# EAGLE design legatus_v0_3 (EAGLE 9.6.2)
CNAME: Parrot Teensy Board; CREVISION: 1.0; DESIGNER: Nathan Villicana-Shaw

## Sheet 1 of 3
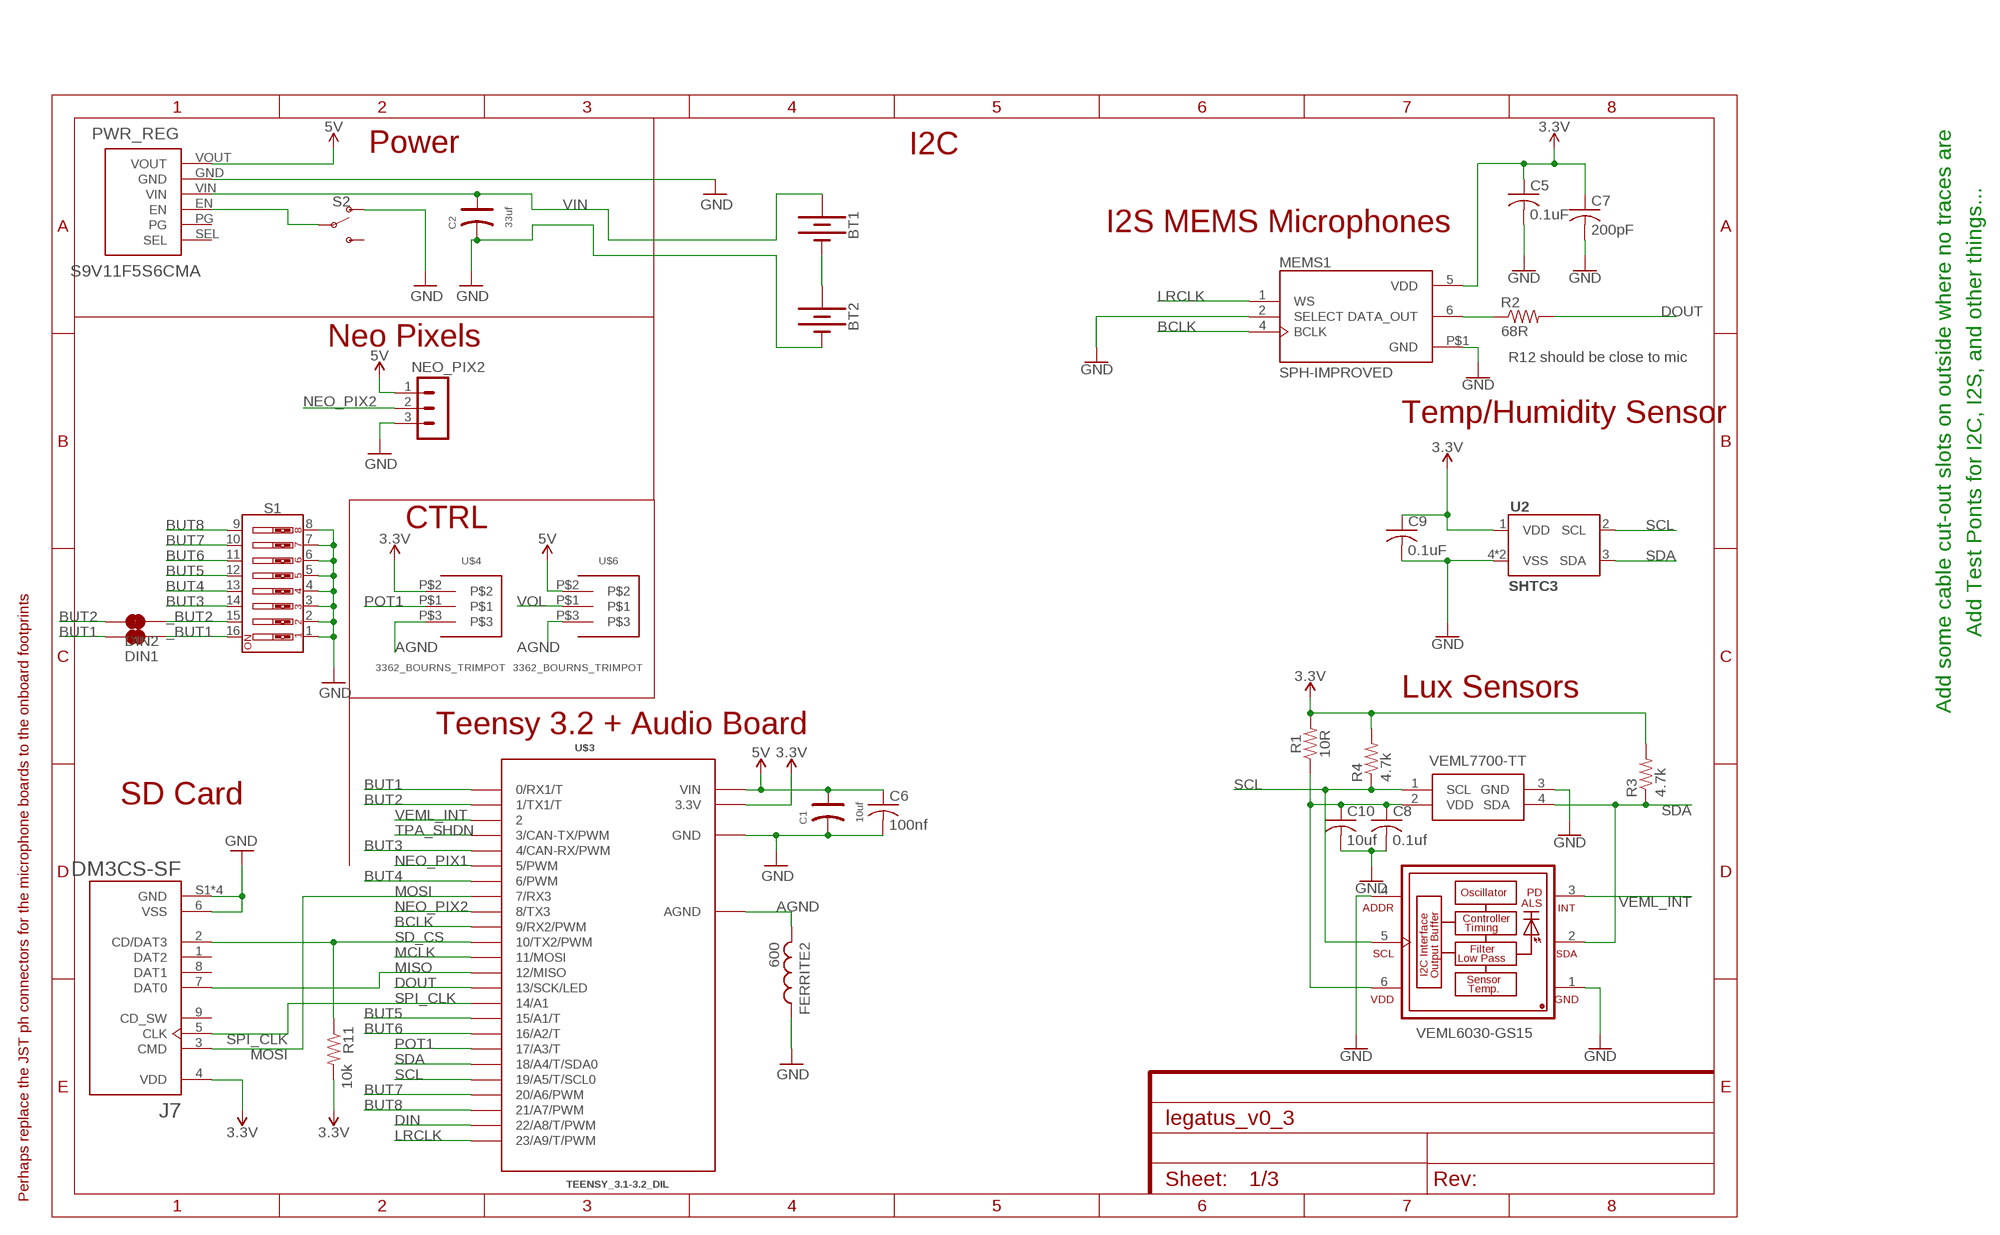
[diagram p0: schematic, sheet 1]

### Parts
BT1  BATTERY-18650  [BATTERY_18650-HOLDER]
BT2  BATTERY-18650  [BATTERY_18650-HOLDER]
C1  10uf  DIP-ALUMINUM-47UF-16V(D5-H7MM)  [PC-D5.3MM]
C2  33uf  DIP-ALUMINUM-47UF-16V(D5-H7MM)  [PC-D5.3MM]
C5  0.1uF  C-USC0805  [C0805]
C6  100nf  C-USC2012  [C2012]
C7  200pF  C-USC0805  [C0805]
C8  0.1uf  C-USC0805  [C0805]
C9  0.1uF  C-USC0805  [C0805]
C10  10uf  C-USC0805  [C0805]
DIN1  JUMPER-SMT_2_NC_TRACE_SILK  [SMT-JUMPER_2_NC_TRACE_SILK]
DIN2  JUMPER-SMT_2_NC_TRACE_SILK  [SMT-JUMPER_2_NC_TRACE_SILK]
FERRITE2  600  INDUCTOR_0805_N  [RESC0805_N]
J7  DM3CS-SF  [HRS_DM3CS-SF]
MEMS1  SPH-IMPROVED  [MIC_SPH0645LM4H-B_LARGER_RING]
NEO_PIX2  B3B-PH-K  [B3B-PH-K]
PWR_REG  S9V11F5S6CMA  [S9V11F3S5CMA]
R1  10R  R-US_R0805  [R0805]
R2  68R  R-US_M0805  [M0805]
R3  4.7k  R-US_M0805  [M0805]
R4  4.7k  R-US_M0805  [M0805]
R11  10k  R-US_M0805  [M0805]
S1  DIP-08-PTH  [DIPSWITCH-08]
S2  SWITCH-SPDT-PTH-11.6X4.0MM-LOCK  [SWITCH_SPDT_PTH_11.6X4.0MM_LOCK]
U2  SHTC3  [SHTC3]
U$3  TEENSY_3.1-3.2_DIL  [TEENSY_3.0-3.2&LC_DIL]
U$4  3362_BOURNS_TRIMPOT  [3362_BOURNS_TRIMPOT]
U$6  3362_BOURNS_TRIMPOT  [3362_BOURNS_TRIMPOT]
VEML1  VEML7700-TT  [VEML7700]
VMEL1  VEML6030-GS15  [VISHAY_VEML6030_2X2X0.87]

### Nets
3.3V [3.3V]: C5.1 C7.1 C9.1 J7.4(VDD) MEMS1.5(VDD) R1.2 R3.2 R4.2 R11.2 U2.1(VDD) U$3.3.3V U$4.P$2 ; also sheet 3
5V: C1.+ C6.1 NEO_PIX2.1 PWR_REG.VOUT U$3.VIN U$6.P$2 ; also sheet 2,3
_BUT1: DIN1.2 S1.16
_BUT2: DIN2.2 S1.15
AGND [AGND]: FERRITE2.2 U$3.AGND U$4.P$3 U$6.P$3 ; also sheet 3
BCLK: MEMS1.4(BCLK) U$3.9(9/RX2/PWM) ; also sheet 3
BUT1: DIN1.1 U$3.0(0/RX1/T)
BUT2: DIN2.1 U$3.1(1/TX1/T)
BUT3: S1.14 U$3.4(4/CAN-RX/PWM)
BUT4: S1.13 U$3.6(6/PWM)
BUT5: S1.12 U$3.15/A1(15/A1/T)
BUT6: S1.11 U$3.16/A2(16/A2/T)
BUT7: S1.10 U$3.20/A6(20/A6/PWM)
BUT8: S1.9 U$3.21/A7(21/A7/PWM)
DIN: U$3.22/A8(22/A8/T/PWM) ; also sheet 3
DOUT: R2.2 U$3.13(13/SCK/LED) ; also sheet 3
GND: BT2.GND@1(-) C1.- C2.- C5.2 C6.2 C7.2 C8.2 C9.2 C10.2 FERRITE2.1 J7.6(VSS) J7.S1(GND) J7.S2(GND) J7.S3(GND) J7.S5(GND) MEMS1.2(SELECT) MEMS1.P$1(GND) NEO_PIX2.3 PWR_REG.GND S1.1 S1.2 S1.3 S1.4 S1.5 S1.6 S1.7 S1.8 S2.1(O) U2.4(VSS) U2.5(VSS) U$3.GND VEML1.3(GND) VMEL1.1(GND) VMEL1.4(ADDR) ; also sheet 2,3
LRCLK: MEMS1.1(WS) U$3.23/A9(23/A9/T/PWM) ; also sheet 3
MCLK: U$3.11(11/MOSI) ; also sheet 3
MISO: J7.7(DAT0) U$3.12(12/MISO)
MOSI: J7.3(CMD) U$3.7(7/RX3)
N$1: MEMS1.6(DATA_OUT) R2.1
N$4: C8.1 C10.1 R1.1 VEML1.2(VDD) VMEL1.6(VDD)
N$5: PWR_REG.EN S2.2(P)
N$22: BT1.GND@1(-) BT2.PWR@1(+)
NEO_PIX1: U$3.5(5/PWM) ; also sheet 2
NEO_PIX2: NEO_PIX2.2 U$3.8(8/TX3)
POT1: U$3.17/A3(17/A3/T) U$4.P$1
SCL: R4.1 U2.2(SCL) U$3.19/A5(19/A5/T/SCL0) VEML1.1(SCL) VMEL1.5(SCL) ; also sheet 3
SD_CS: J7.2(CD/DAT3) R11.1 U$3.10(10/TX2/PWM)
SDA: R3.1 U2.3(SDA) U$3.18/A4(18/A4/T/SDA0) VEML1.4(SDA) VMEL1.2(SDA) ; also sheet 3
SPI_CLK: J7.5(CLK) U$3.14/A0(14/A1)
TPA_SHDN: U$3.3(3/CAN-TX/PWM) ; also sheet 3
VEML_INT: U$3.2 VMEL1.3(INT)
VIN [12V_IN]: BT1.PWR@1(+) C2.+ PWR_REG.VIN
VOL: U$6.P$1 ; also sheet 3
Unconnected: J7.1(DAT2) J7.8(DAT1) J7.9(CD_SW) PWR_REG.PG PWR_REG.SEL S2.3(S)

### Notes on the sheet
- Power | I2C
- I2S MEMS Microphones
- Neo Pixels
- R12 should be close to mic
- Temp/Humidity Sensor
- CTRL
- Add Test Ponts for I2C, I2S, and other things...
- Lux Sensors
- Add some cable cut-out slots on outside where no traces are
- Teensy 3.2 + Audio Board
- 10R
- SD Card
- Perhaps replace the JST ph connectors for the microphone boards to the onboard footprints

## Sheet 2 of 3: Neopixel LEDs
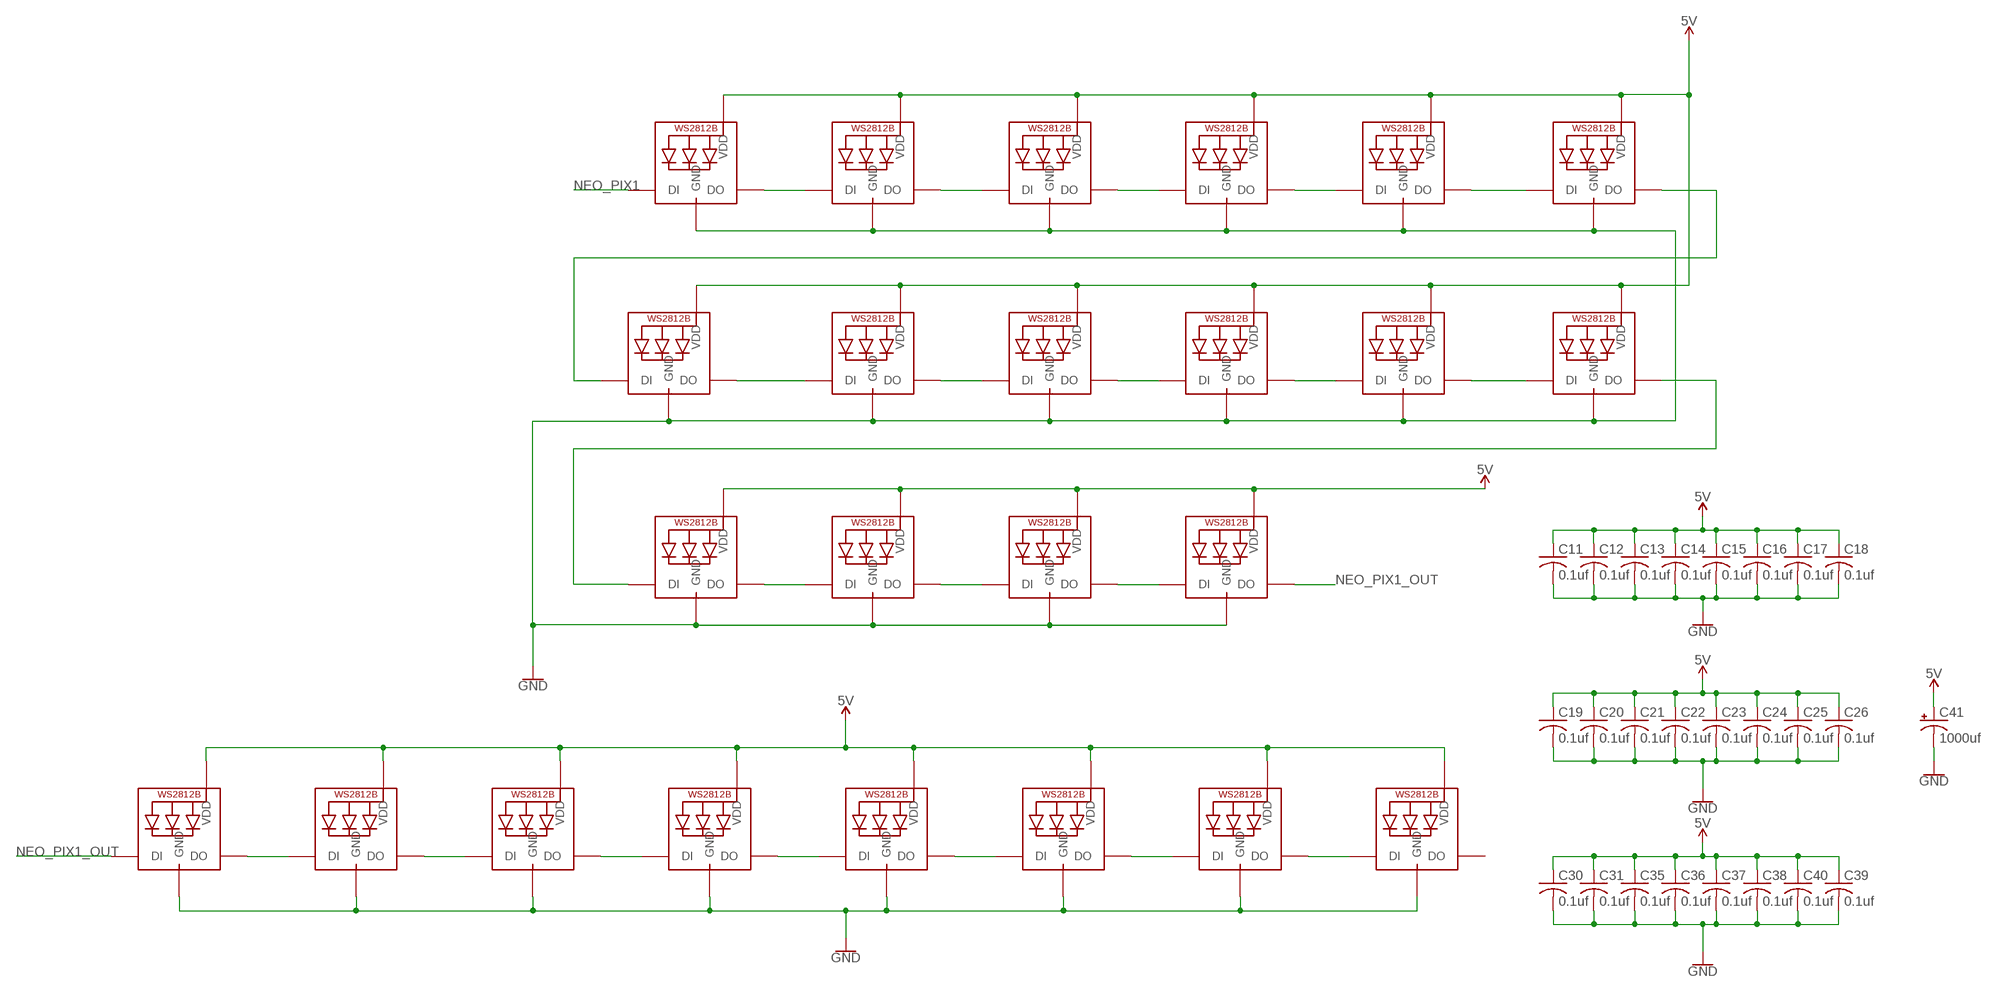
[diagram p1: schematic, sheet 2]

### Parts
C11  0.1uf  C-USC0805  [C0805]
C12  0.1uf  C-USC0805  [C0805]
C13  0.1uf  C-USC0805  [C0805]
C14  0.1uf  C-USC0805  [C0805]
C15  0.1uf  C-USC0805  [C0805]
C16  0.1uf  C-USC0805  [C0805]
C17  0.1uf  C-USC0805  [C0805]
C18  0.1uf  C-USC0805  [C0805]
C19  0.1uf  C-USC0805  [C0805]
C20  0.1uf  C-USC0805  [C0805]
C21  0.1uf  C-USC0805  [C0805]
C22  0.1uf  C-USC0805  [C0805]
C23  0.1uf  C-USC0805  [C0805]
C24  0.1uf  C-USC0805  [C0805]
C25  0.1uf  C-USC0805  [C0805]
C26  0.1uf  C-USC0805  [C0805]
C30  0.1uf  C-USC0805  [C0805]
C31  0.1uf  C-USC0805  [C0805]
C35  0.1uf  C-USC0805  [C0805]
C36  0.1uf  C-USC0805  [C0805]
C37  0.1uf  C-USC0805  [C0805]
C38  0.1uf  C-USC0805  [C0805]
C39  0.1uf  C-USC0805  [C0805]
C40  0.1uf  C-USC0805  [C0805]
C41  1000uf  CPOL-US153CLV-1010  [153CLV-1010]
LED1  WS2812B_5050N  [WS2812B-NARROW]
LED2  WS2812B_5050N  [WS2812B-NARROW]
LED3  WS2812B_5050N  [WS2812B-NARROW]
LED4  WS2812B_5050N  [WS2812B-NARROW]
LED5  WS2812B_5050N  [WS2812B-NARROW]
LED6  WS2812B_5050N  [WS2812B-NARROW]
LED7  WS2812B_5050N  [WS2812B-NARROW]
LED8  WS2812B_5050N  [WS2812B-NARROW]
LED9  WS2812B_5050N  [WS2812B-NARROW]
LED10  WS2812B_5050N  [WS2812B-NARROW]
LED11  WS2812B_5050N  [WS2812B-NARROW]
LED12  WS2812B_5050N  [WS2812B-NARROW]
LED13  WS2812B_5050N  [WS2812B-NARROW]
LED14  WS2812B_5050N  [WS2812B-NARROW]
LED15  WS2812B_5050N  [WS2812B-NARROW]
LED16  WS2812B_5050N  [WS2812B-NARROW]
LED17  WS2812B_5050N  [WS2812B-NARROW]
LED18  WS2812B_5050N  [WS2812B-NARROW]
LED19  WS2812B_5050N  [WS2812B-NARROW]
LED20  WS2812B_5050N  [WS2812B-NARROW]
LED21  WS2812B_5050N  [WS2812B-NARROW]
LED22  WS2812B_5050N  [WS2812B-NARROW]
LED23  WS2812B_5050N  [WS2812B-NARROW]
LED24  WS2812B_5050N  [WS2812B-NARROW]

### Nets
5V: C11.1 C12.1 C13.1 C14.1 C15.1 C16.1 C17.1 C18.1 C19.1 C20.1 C21.1 C22.1 C23.1 C24.1 C25.1 C26.1 C30.1 C31.1 C35.1 C36.1 C37.1 C38.1 C39.1 C40.1 C41.+ LED1.1-VDD(VDD) LED2.1-VDD(VDD) LED3.1-VDD(VDD) LED4.1-VDD(VDD) LED5.1-VDD(VDD) LED6.1-VDD(VDD) LED7.1-VDD(VDD) LED8.1-VDD(VDD) LED9.1-VDD(VDD) LED10.1-VDD(VDD) LED11.1-VDD(VDD) LED12.1-VDD(VDD) LED13.1-VDD(VDD) LED14.1-VDD(VDD) LED15.1-VDD(VDD) LED16.1-VDD(VDD) LED17.1-VDD(VDD) LED18.1-VDD(VDD) LED19.1-VDD(VDD) LED20.1-VDD(VDD) LED21.1-VDD(VDD) LED22.1-VDD(VDD) LED23.1-VDD(VDD) LED24.1-VDD(VDD) ; also sheet 1,3
GND: C11.2 C12.2 C13.2 C14.2 C15.2 C16.2 C17.2 C18.2 C19.2 C20.2 C21.2 C22.2 C23.2 C24.2 C25.2 C26.2 C30.2 C31.2 C35.2 C36.2 C37.2 C38.2 C39.2 C40.2 C41.- LED1.3-GND(GND) LED2.3-GND(GND) LED3.3-GND(GND) LED4.3-GND(GND) LED5.3-GND(GND) LED6.3-GND(GND) LED7.3-GND(GND) LED8.3-GND(GND) LED9.3-GND(GND) LED10.3-GND(GND) LED11.3-GND(GND) LED12.3-GND(GND) LED13.3-GND(GND) LED14.3-GND(GND) LED15.3-GND(GND) LED16.3-GND(GND) LED17.3-GND(GND) LED18.3-GND(GND) LED19.3-GND(GND) LED20.3-GND(GND) LED21.3-GND(GND) LED22.3-GND(GND) LED23.3-GND(GND) LED24.3-GND(GND) ; also sheet 1,3
N$9: LED1.2-DOUT(DO) LED2.4-DIN(DI)
N$10: LED2.2-DOUT(DO) LED3.4-DIN(DI)
N$11: LED3.2-DOUT(DO) LED4.4-DIN(DI)
N$12: LED4.2-DOUT(DO) LED5.4-DIN(DI)
N$13: LED5.2-DOUT(DO) LED6.4-DIN(DI)
N$14: LED7.2-DOUT(DO) LED8.4-DIN(DI)
N$15: LED8.2-DOUT(DO) LED9.4-DIN(DI)
N$16: LED9.2-DOUT(DO) LED10.4-DIN(DI)
N$17: LED10.2-DOUT(DO) LED11.4-DIN(DI)
N$18: LED11.2-DOUT(DO) LED12.4-DIN(DI)
N$19: LED13.2-DOUT(DO) LED14.4-DIN(DI)
N$20: LED14.2-DOUT(DO) LED15.4-DIN(DI)
N$21: LED15.2-DOUT(DO) LED16.4-DIN(DI)
N$23: LED12.2-DOUT(DO) LED13.4-DIN(DI)
N$24: LED6.2-DOUT(DO) LED7.4-DIN(DI)
N$26: LED18.2-DOUT(DO) LED19.4-DIN(DI)
N$29: LED19.2-DOUT(DO) LED20.4-DIN(DI)
N$30: LED20.2-DOUT(DO) LED21.4-DIN(DI)
N$31: LED21.2-DOUT(DO) LED22.4-DIN(DI)
N$33: LED22.2-DOUT(DO) LED23.4-DIN(DI)
N$37: LED23.2-DOUT(DO) LED24.4-DIN(DI)
N$43: LED17.2-DOUT(DO) LED18.4-DIN(DI)
NEO_PIX1: LED1.4-DIN(DI) ; also sheet 1
NEO_PIX1_OUT: LED16.2-DOUT(DO) LED17.4-DIN(DI)
Unconnected: LED24.2-DOUT(DO)

## Sheet 3 of 3: Audio
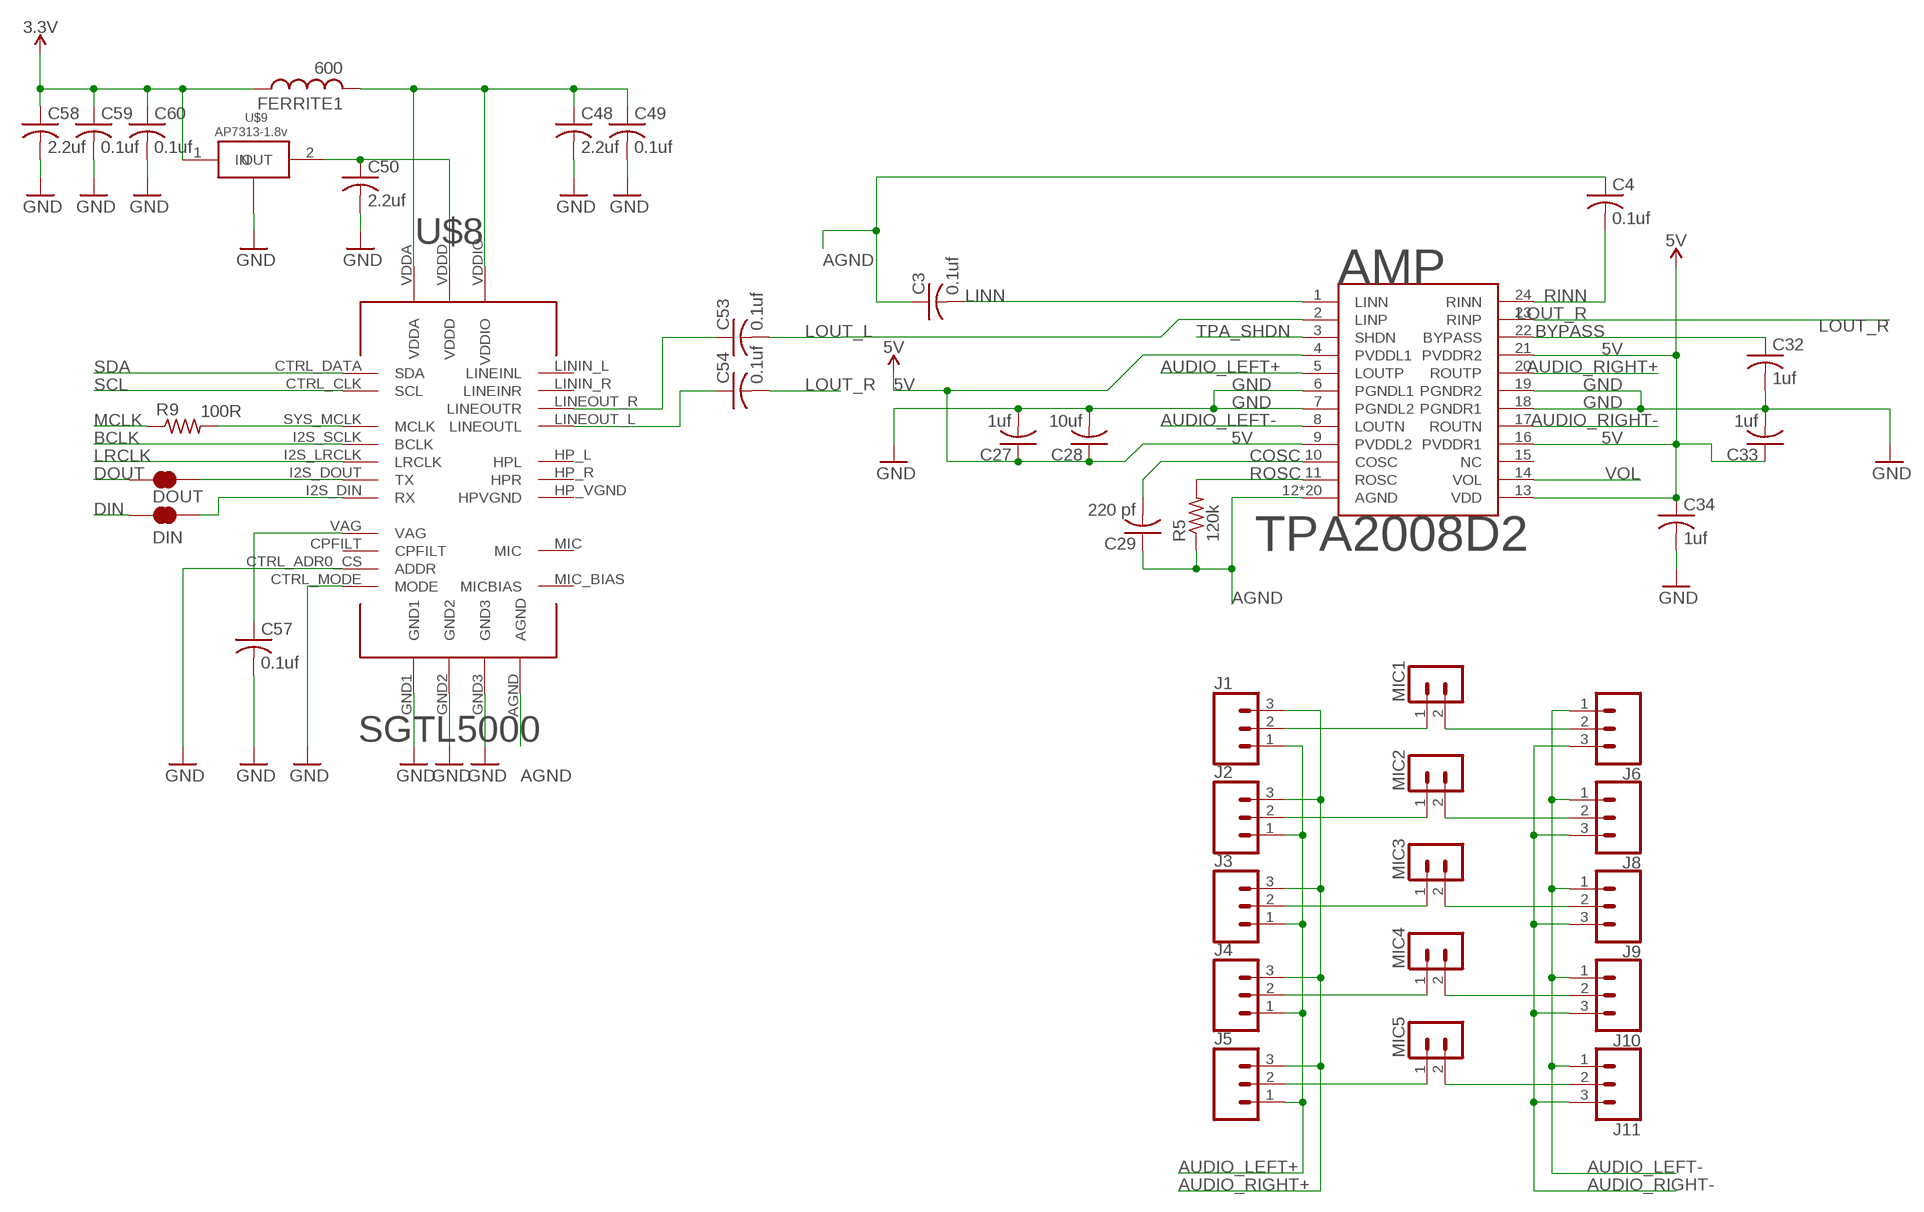
[diagram p2: schematic, sheet 3]

### Parts
AMP  TPA2008D2  [PWP-TSSOP24]
C3  0.1uf  C-USC0805  [C0805]
C4  0.1uf  C-USC0805  [C0805]
C27  1uf  C-USC0805  [C0805]
C28  10uf  C-USC0805  [C0805]
C29  220 pf  C-USC0805  [C0805]
C32  1uf  C-USC0805  [C0805]
C33  1uf  C-USC0805  [C0805]
C34  1uf  C-USC0805  [C0805]
C48  2.2uf  C-USC0805  [C0805]
C49  0.1uf  C-USC0805  [C0805]
C50  2.2uf  C-USC0805  [C0805]
C53  0.1uf  C-USC0805  [C0805]
C54  0.1uf  C-USC0805  [C0805]
C57  0.1uf  C-USC0805  [C0805]
C58  2.2uf  C-USC0805  [C0805]
C59  0.1uf  C-USC0805  [C0805]
C60  0.1uf  C-USC0805  [C0805]
DIN  JUMPER-SMT_2_NC_TRACE_SILK  [SMT-JUMPER_2_NC_TRACE_SILK]
DOUT  JUMPER-SMT_2_NC_TRACE_SILK  [SMT-JUMPER_2_NC_TRACE_SILK]
FERRITE1  600  INDUCTOR_0805_N  [RESC0805_N]
J1  CONN_03  [1X03]
J2  CONN_03  [1X03]
J3  CONN_03  [1X03]
J4  CONN_03  [1X03]
J5  CONN_03  [1X03]
J6  CONN_03  [1X03]
J8  CONN_03  [1X03]
J9  CONN_03  [1X03]
J10  CONN_03  [1X03]
J11  CONN_03  [1X03]
MIC1  B2B-PH-K  [B2B-PH-K]
MIC2  B2B-PH-K  [B2B-PH-K]
MIC3  B2B-PH-K  [B2B-PH-K]
MIC4  B2B-PH-K  [B2B-PH-K]
MIC5  B2B-PH-K  [B2B-PH-K]
R5  120k  R-US_M0805  [M0805]
R9  100R  R-US_M0805  [M0805]
U$8  SGTL5000  [QFN-32-5X5MM]
U$9  AP7313-1.8v  AP7313  [SOT-23]

### Nets
3.3V [3.3V]: C58.1 C59.1 C60.1 FERRITE1.1 U$9.1(IN) ; also sheet 1
5V: AMP.4(PVDDL1) AMP.9(PVDDL2) AMP.13(VDD) AMP.16(PVDDR1) AMP.21(PVDDR2) C27.1 C28.1 C33.1 C34.1 ; also sheet 1,2
AGND [AGND]: AMP.12(AGND) AMP.EXP(AGND) AMP.EXP@1(AGND) AMP.EXP@2(AGND) AMP.EXP@3(AGND) AMP.EXP@4(AGND) AMP.EXP@5(AGND) AMP.EXP@6(AGND) AMP.EXP@7(AGND) AMP.EXP@8(AGND) AMP.EXP@9(AGND) AMP.EXP@10(AGND) AMP.EXP@11(AGND) AMP.EXP@12(AGND) AMP.EXP@13(AGND) AMP.EXP@14(AGND) AMP.EXP@15(AGND) AMP.EXP@16(AGND) AMP.EXP@17(AGND) AMP.EXP@18(AGND) C3.1 C4.1 C29.1 R5.1 U$8.AGND ; also sheet 1
AUDIO_LEFT+: AMP.5(LOUTP) J1.1 J2.1 J3.1 J4.1 J5.1
AUDIO_LEFT-: AMP.8(LOUTN) J6.1 J8.1 J9.1 J10.1 J11.1
AUDIO_RIGHT+: AMP.20(ROUTP) J1.3 J2.3 J3.3 J4.3 J5.3
AUDIO_RIGHT-: AMP.17(ROUTN) J6.3 J8.3 J9.3 J10.3 J11.3
BCLK: U$8.I2S_SCLK(BCLK) ; also sheet 1
BYPASS: AMP.22(BYPASS) C32.1
COSC: AMP.10(COSC) C29.2
DIN: DIN.1 ; also sheet 1
DOUT: DOUT.1 ; also sheet 1
EDITROUTE: C48.1 C49.1 FERRITE1.2 U$8.VDDA U$8.VDDIO
GND: AMP.6(PGNDL1) AMP.7(PGNDL2) AMP.18(PGNDR1) AMP.19(PGNDR2) C27.2 C28.2 C32.2 C33.2 C34.2 C48.2 C49.2 C50.2 C57.2 C58.2 C59.2 C60.2 U$8.CTRL_ADR0_CS(ADDR) U$8.CTRL_MODE(MODE) U$8.GND1 U$8.GND2 U$8.GND3 U$9.3(GND) ; also sheet 1,2
LINN [AGND]: AMP.1(LINN) C3.2
LOUT_L: AMP.2(LINP) C53.2
LOUT_R: AMP.23(RINP) C54.2
LRCLK: U$8.I2S_LRCLK(LRCLK) ; also sheet 1
MCLK: R9.1 ; also sheet 1
N$2: J1.2 MIC1.1
N$3: J2.2 MIC2.1
N$6: J3.2 MIC3.1
N$7: J4.2 MIC4.1
N$8: J5.2 MIC5.1
N$25: J6.2 MIC1.2
N$27: C53.1 U$8.LINEOUT_R(LINEOUTR)
N$28: C54.1 U$8.LINEOUT_L(LINEOUTL)
N$32: J8.2 MIC2.2
N$34: C57.1 U$8.VAG
N$35: DIN.2 U$8.I2S_DIN(RX)
N$36: DOUT.2 U$8.I2S_DOUT(TX)
N$38: R9.2 U$8.SYS_MCLK(MCLK)
N$39: C50.1 U$8.VDDD U$9.2(OUT)
N$40: J9.2 MIC3.2
N$42: J10.2 MIC4.2
N$44: J11.2 MIC5.2
RINN [AGND]: AMP.24(RINN) C4.2
ROSC: AMP.11(ROSC) R5.2
SCL: U$8.CTRL_CLK(SCL) ; also sheet 1
SDA: U$8.CTRL_DATA(SDA) ; also sheet 1
TPA_SHDN: AMP.3(SHDN) ; also sheet 1
VOL: AMP.14(VOL) ; also sheet 1
Unconnected: AMP.15(NC) U$8.CPFILT U$8.HP_L(HPL) U$8.HP_R(HPR) U$8.HP_VGND(HPVGND) U$8.LININ_L(LINEINL) U$8.LININ_R(LINEINR) U$8.MIC U$8.MIC_BIAS(MICBIAS)

## Library data of the parts
AMP = TPA2008D3:TPA2008D2
BT1 BT2 = SparkFun-Batteries:BATTERY: Battery - Single Cell A variety of battery chemistries, sizes, and footprints. Device List: 20MM_PTH - Coin Cell Battery Holder - 20mm (PTH) <https://www.sparkfun.com/products/783> 6.8MM_PTH - Coin Cell Battery Holder - 6.8MM(SMD) <https://www.digikey.com/product-detail/en/seiko-instruments/MS621FE-FL11E/728-1057-ND/1889208?WT.srch=1&gclid=CNOQ5a6LzdQCFZS2wAodXCkE0g> 12MM_SMD - Coin Cell Battery Holder - 12mm (SMD) <https://www.sparkfun.com/products/10592> 12MM_PTH - Coin Cell Battery Holder - 12mm (PTH) <https://www.sparkfun.com/products/7948> 20MM_SMD - 20mm Coin Cell Battery Holder (SMD) (2 legs) Used on the Big Time Watch Kit <https://www.sparkfun.com/products/11734> 20MM_SMD_4LEGS - Coin Cell Battery Holder - 20mm (SMD) <https://www.sparkfun.com/products/11892> 20MM_SMD_4LEGS_OVERPASTE - Coin Cell Battery Holder - 20mm (SMD) <https://www.sparkfun.com/products/11892> (Over-paste on the legs) 24.5MM_PTH - Coin Cell Battery Holder - 24.5mm (PTH) <https://www.sparkfun.com/products/8863> 9V - 9V Battery Holder - PC Mount Used on the SparkFun SparkPunk Sound Kit <https://www.sparkfun.com/products/11177> and SparkFun SparkPunk Sequencer Kit <https://www.sparkfun.com/products/12707> 18650 - Battery Holder - 18650 (PTH) <https://www.sparkfun.com/products/13113> AA - Battery Holder - 1xAA (PTH) <https://www.sparkfun.com/products/7949> AAA - Battery Holder - 1xAAA (PTH) <https://www.sparkfun.com/products/12718> AA_KIT - Battery Holder - 1xAA (PTH) <https://www.sparkfun.com/products/7949> Special kit package - pads only have exposed copper on one side of the board. AAA_KIT - Battery Holder - 1xAAA (PTH) <https://www.sparkfun.com/products/12718> Special kit package - pads only have exposed copper on one side of the board.; PROD_ID: BATT-12327; SF_SKU: PRT-13113
C1 C2 = Seeed-Capacitor:DIP-ALUMINUM-47UF-16V(D5-H7MM): 302030033; MPN: KS 100uF/16V; VALUE: 100uf
C3-C5 C7-C40 C48-C50 C53 C54 C57-C60 = rcl:C-US: CAPACITOR, American symbol; SPICEPREFIX: C
C6 = adafruit:C-US: CAPACITOR, American symbol
C41 = adafruit:CPOL-US: POLARIZED CAPACITOR, American symbol
DIN DIN1 DIN2 DOUT = SparkFun-Jumpers:JUMPER-SMT_2_NC_TRACE: Normally closed trace jumper This jumper has a trace between two pads so it's normally closed (NC). Use a razor knife to open the connection. For best results follow the IPC guidelines for cutting traces: Cutout at least 0.063 mm (0.005 in). Remove all loose material to clean up the cut area. Seal the cut with an approved epoxy. Reapply solder to reclose the connection.
FERRITE1 FERRITE2 = Nordic_nRF:INDUCTOR: Generic chip inductor
J1-J6 J8-J11 = SparkFun-Connectors:CONN_03: Multi connection point. Often used as Generic Header-pin footprint for 0.1 inch spaced/style header connections On any of the 0.1 inch spaced packages, you can populate with these: Break Away Headers - Straight <https://www.sparkfun.com/products/116> (PRT-00116) Break Away Male Headers - Right Angle <https://www.sparkfun.com/products/553> (PRT-00553) Female Headers <https://www.sparkfun.com/products/115> (PRT-00115) Break Away Headers - Machine Pin <https://www.sparkfun.com/products/117> (PRT-00117) Break Away Female Headers - Swiss Machine Pin <https://www.sparkfun.com/products/743> (PRT-00743) Stackable Header - 3 Pin (Female, 0.1") <https://www.sparkfun.com/products/13875> (PRT-13875) For SCREWTERMINALS and SPRING TERMINALS visit here: Screw Terimnals on SparkFun.com <https://www.sparkfun.com/search/results?term=Screw+Terminals> (5mm/3.5mm/2.54mm spacing) This device is also useful as a general connection point to wire up your design to another part of your project. Our various solder wires solder well into these plated through hole pads. Hook-Up Wire - Assortment (Stranded, 22 AWG) <https://www.sparkfun.com/products/11375> (PRT-11375) Hook-Up Wire - Assortment (Solid Core, 22 AWG) <https://www.sparkfun.com/products/11367> (PRT-11367) View the entire wire category on our website here <https://www.sparkfun.com/categories/141> Special notes: Molex polarized connector foot print use with SKU : PRT-08232 with associated crimp pins and housings.
J7 = DM3CS-SF:DM3CS-SF: CONN MICRO SD CARD HINGED TYPE; AVAILABILITY: Unavailable; DESCRIPTION: 10 (8 + 2) Position Card Connector Secure Digital - microSD™ Surface Mount, Right Angle Gold; MF: Hirose; MP: DM3CS-SF; PACKAGE: None; PRICE: None
LED1-LED24 = nathans-custom-parts:WS2812B
MEMS1 = SPH0645LM4H-B:SPH-IMPROVED
MIC1-MIC5 = con-jst-ph:B2B-PH-K: HEADER
NEO_PIX2 = con-jst-ph:B3B-PH-K: HEADER
PWR_REG = nathans-custom-parts:S9V11F5S6CMA
R1 = audio amplifier example:R-US_: RESISTOR, American symbol
R2-R5 = adafruit:R-US_: RESISTOR, American symbol
R9 R11 = rcl:R-US_: RESISTOR, American symbol; SPICEPREFIX: R
S1 = SparkFun-Switches:DIP-08: 8-Position DIP Switch 8-circuit DIP (dual inline package) switch. Commonly used to physcially set a circuit's behavior. SparkFun Products DIP Switch - 8 Position <https://www.sparkfun.com/products/8034> (COM-08034); PROD_ID: SWCH-12197; SF_SKU: COM-08034
S2 = SparkFun-Switches:SWITCH-SPDT: Single Pole, Double Throw (SPDT) Switch Single-pole, double-throw (SPDT) switch. Variant Overview SMD-AYZ0202 Surface Mount DPDT Switch <https://www.sparkfun.com/products/597> (COM-00597) Used on e.g. LilyPad Arduino USB - ATmega32U4 Board <https://www.sparkfun.com/products/12049> PTH-11.6X4.0MM SPDT Mini Power Switch <https://www.sparkfun.com/products/102> (COM-00102) Used on e.g. SparkFun Simon Says - Through-Hole Soldering Kit <https://www.sparkfun.com/products/10547> (KIT-10547) PTH-11.6X4.0MM-KIT KIT version of SPDT Mini Power Switch - Simplifies soldering by removing tStop of switch pins - only one side can be soldered. PTH-11.6X4.0MM-LOCK LOCK version of SPDT Mini Power Switch - Offset pins hold switch in place for easier soldering. SMD-RIGHT-ANGLE Surface Mount Right Angle Switch <https://www.sparkfun.com/products/10860> (COM-10860) Used on e.g. SparkFun ESP8266 Thing <https://www.sparkfun.com/products/13231>; PROD_ID: SWCH-08261; SF_SKU: COM-00102
U2 = SHTC3:SHTC3
U$3 = teensy_3_and_LC:TEENSY_3.1-3.2_DIL: Teensy 3.1 or 3.2 in a DIL Layout.
U$4 U$6 = nathans-custom-parts:3362_BOURNS_TRIMPOT
U$8 = sgtl5000:SGTL5000
U$9 = AP7313:AP7313
VEML1 = VEML7700-TT:VEML7700-TT: 16Bit Ambient Light Sensor I2C 6.8x2.3mm Source: Datasheet <https://www.arrow.com/en/products/veml7700-tt/vishay>; DESCRIPTION: 16Bit Ambient Light Sensor I2C 6.8x2.3mm; HEIGHT: mm; MANUFACTURER_NAME: Vishay; MANUFACTURER_PART_NUMBER: VEML7700-TT; MOUSER_PART_NUMBER: 78-VEML7700-TT; MOUSER_PRICE-STOCK: https://www.mouser.com/Search/Refine.aspx?Keyword=78-VEML7700-TT; RS_PART_NUMBER: 1226791P; RS_PRICE-STOCK: http://uk.rs-online.com/web/p/products/1226791P
VMEL1 = VEML6030-GS15:VEML6030-GS15: VEML6030 High Accuracy Ambient Light Sensor with I2C Interface: VEML6030 is a high accuracy ambient light digital 16-bit resolution sensor in a miniature transparent 2 mm x 2 mm package. It includes a high sensitive photodiode, a low noise amplifier, a 16-bit A/D converter and supports an easy to use I2C bus communication interface and additional interrupt feature. The ambient light result is as digital value available. Device Model created 15.06.2016 by Johannes Kolb - Vishay Semiconductor GmbH; AVAILABILITY: Unavailable; DESCRIPTION: Optical Sensor Ambient 550nm I²C 6-SMD, No Lead; MF: Vishay Semiconductor; MP: VEML6030-GS15; PACKAGE: SMD-6 Vishay; PRICE: None

## Net classes
0 default: width 0.203 mm, drill 0.254 mm, clearance 0.203 mm
1 12V_IN: width 1.016 mm, drill 0.762 mm, clearance 0.305 mm
2 3.3V: width 0.305 mm, drill 0.508 mm, clearance 0.254 mm
3 5V: width 0.787 mm, drill 0.508 mm, clearance 0.381 mm
4 AGND: width 0.787 mm, drill 0.203 mm, clearance 0.203 mm

## Board
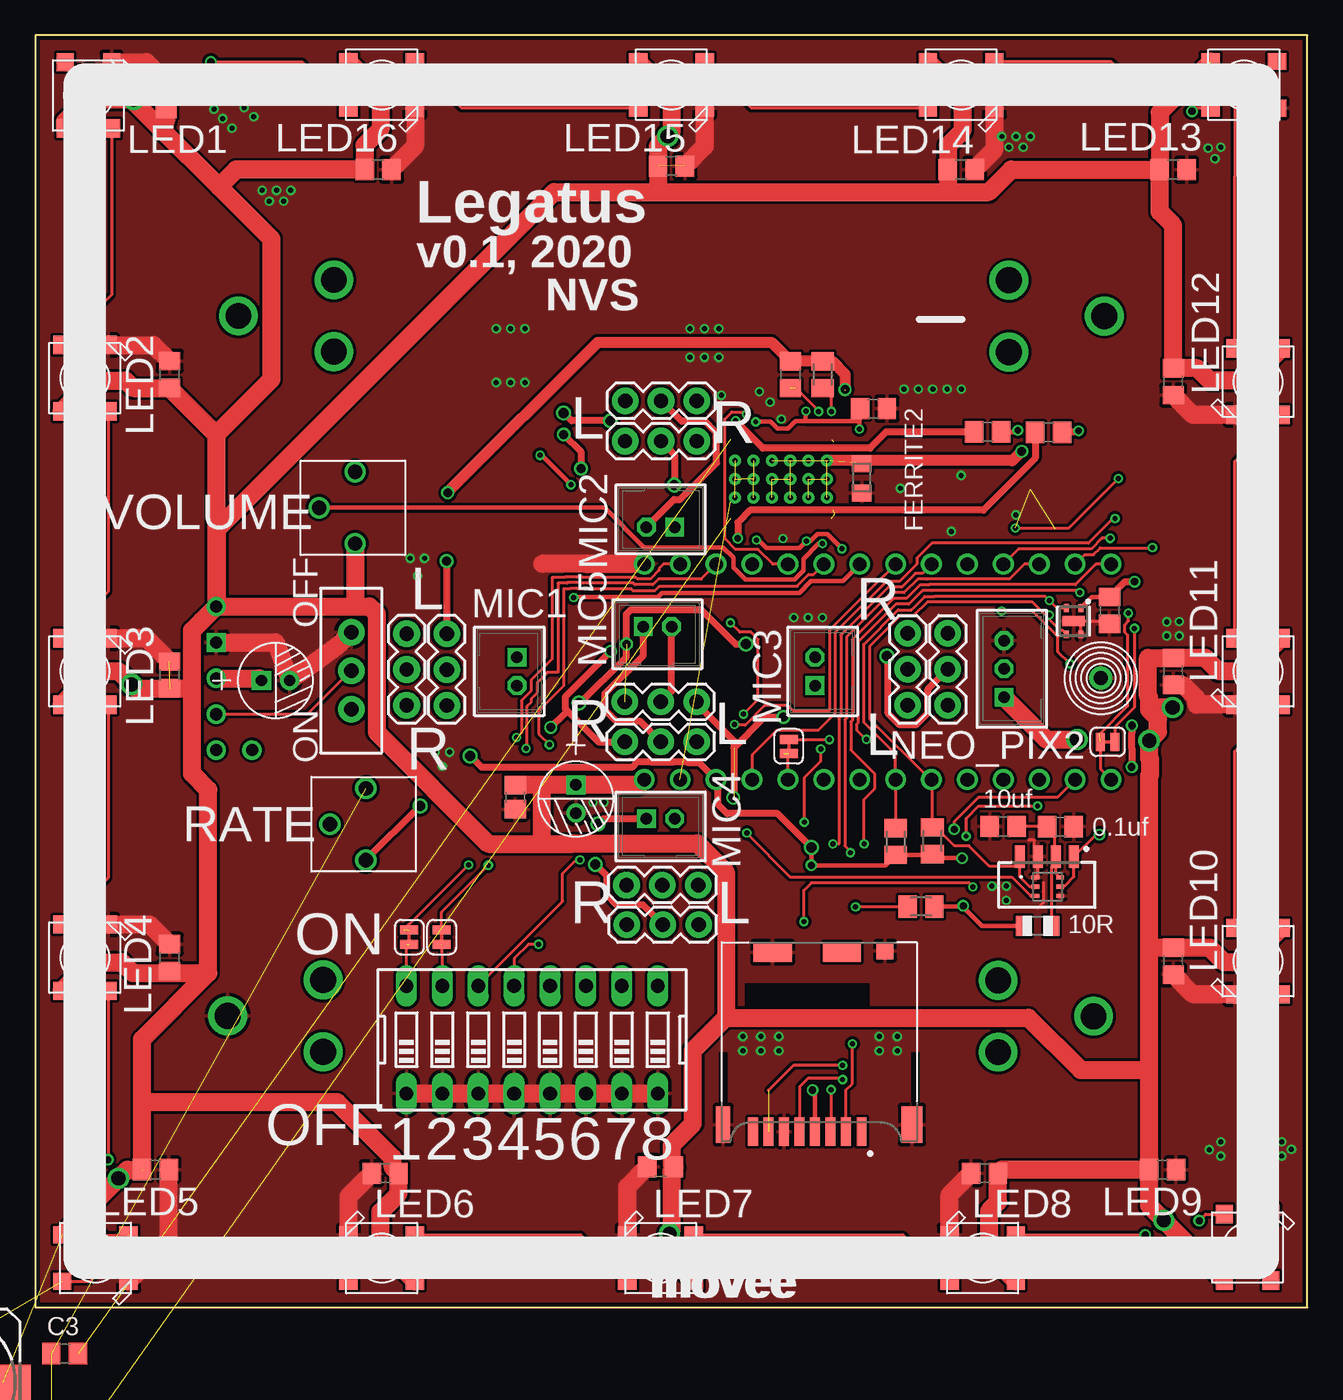
[diagram p3: board, top side]
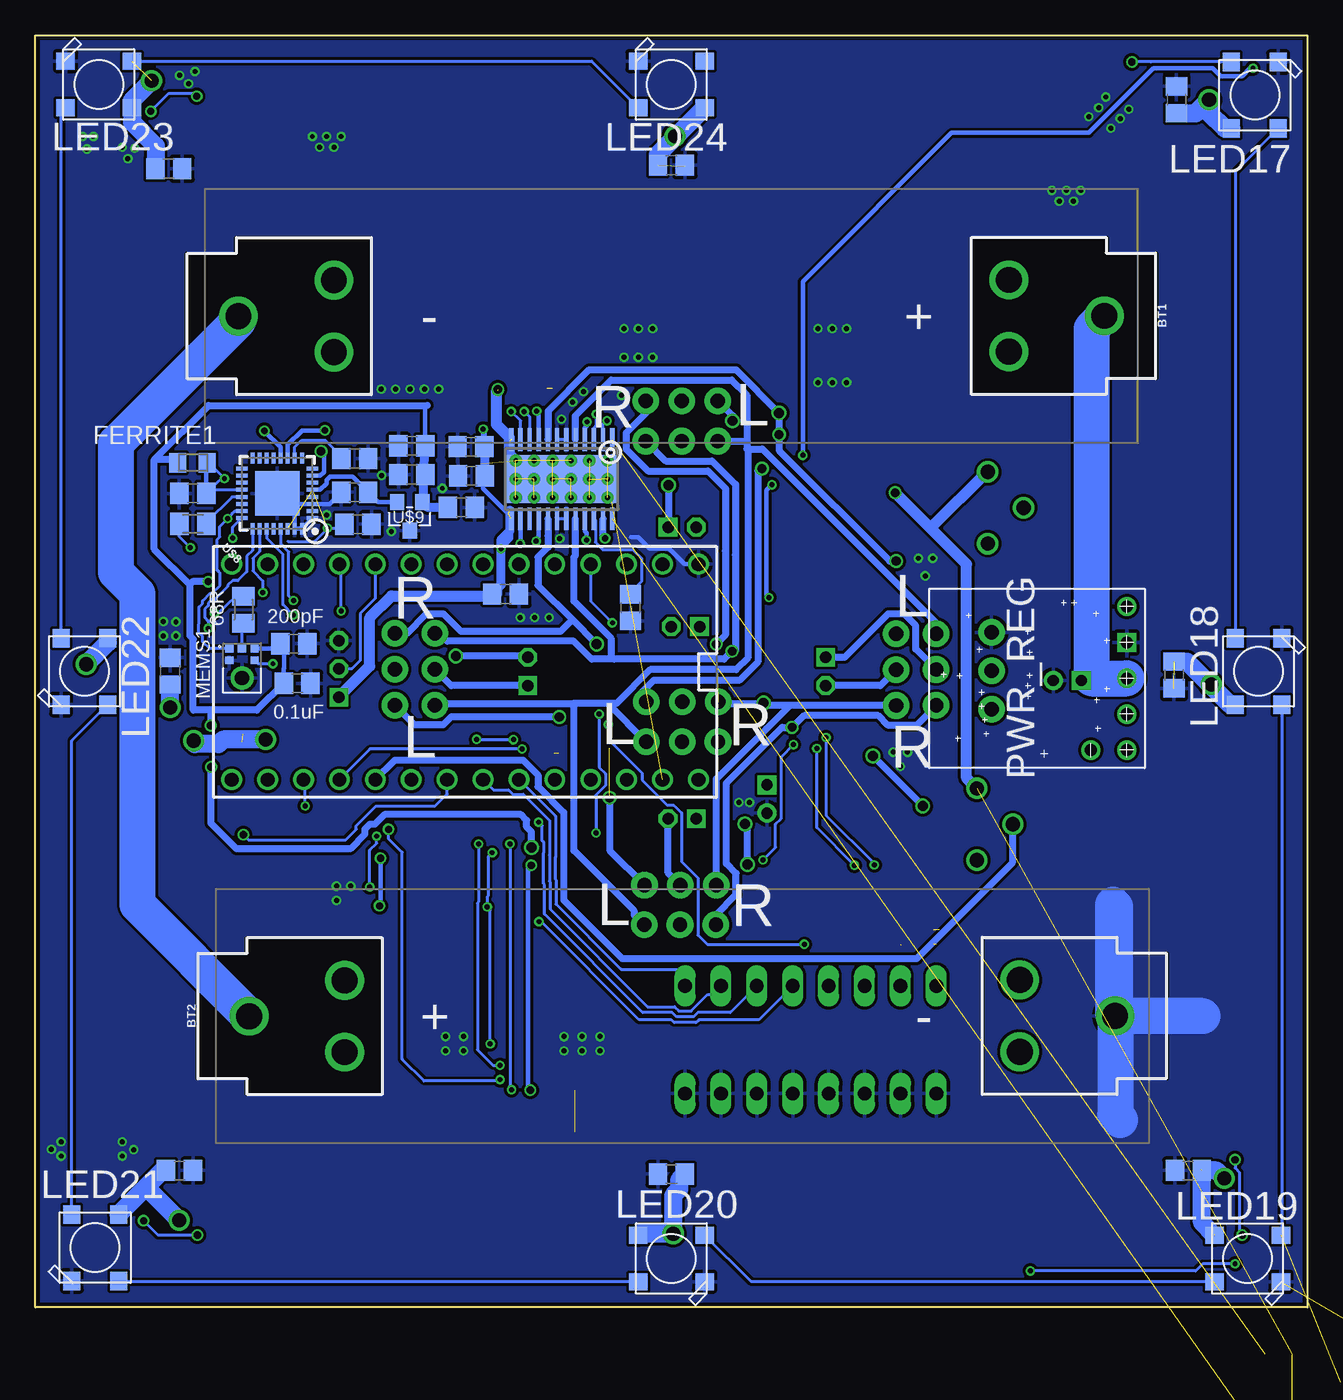
[diagram p4: board, bottom side, seen from below]

Size 90 x 90 mm. Coordinates in mm from the lower left corner, seen from the top.
Outline: 0,90 0,0 90,0 90,90 0,90
Copper layers (1*16): Top 0.035mm / dielectric 1.5mm / Bottom 0.035mm
Design rules "SeeedStudio_2layer_DRU_no_angle_20140221": minimum track width 6mil, minimum drill 12mil, track to track 6mil, track to pad 6mil, pad to pad 6mil, via to via 6mil, smd to smd 0mil, copper to edge 10mil, drill to drill 10mil, minimum pad ring 10mil, minimum via ring 6mil, stop-mask expansion 2mil, vias tented up to drill 100mil, thermal gap 10mil

### Footprints (pad centres in the part's own frame; a part is rotated, then mirrored left to right if it is on the bottom)
PWP-TSSOP24 = smd 1.6 x 0.3: 1 -2.8,3.575; 2 -2.8,2.925; 3 -2.8,2.275; 4 -2.8,1.625; 5 -2.8,0.975; 6 -2.8,0.325; 7 -2.8,-0.325; 8 -2.8,-0.975; 9 -2.8,-1.625; 10 -2.8,-2.275; 11 -2.8,-2.925; 12 -2.8,-3.575; 13 2.8,-3.575; 14 2.8,-2.925; 15 2.8,-2.275; 16 2.8,-1.625; 17 2.8,-0.975; 18 2.8,-0.325; 19 2.8,0.325; 20 2.8,0.975; 21 2.8,1.625; 22 2.8,2.275; 23 2.8,2.925; 24 2.8,3.575 | smd 3.4 x 7.8: EXP 0,0 | drill 0.35 pad 0.7: EXP@1 -1.3,3.25; EXP@2 0,3.25; EXP@3 1.3,3.25; EXP@4 -1.3,1.95; EXP@5 0,1.95; EXP@6 1.3,1.95; EXP@7 -1.3,0.65; EXP@8 0,0.65; EXP@9 1.3,0.65; EXP@10 -1.3,-0.65; EXP@11 0,-0.65; EXP@12 1.3,-0.65; EXP@13 -1.3,-1.95; EXP@14 0,-1.95; EXP@15 1.3,-1.95; EXP@16 -1.3,-3.25; EXP@17 0,-3.25; EXP@18 1.3,-3.25
BATTERY_18650-HOLDER = drill 1.829: GND@1 30.628,0.01; GND@2 23.88,2.55; GND@3 23.88,-2.53; PWR@1 -30.628,-0.01; PWR@2 -23.88,2.53; PWR@3 -23.88,-2.55
PC-D5.3MM = drill 0.8 pad 1.35 square: + -1,0 | drill 0.8 pad 1.35: - 1,0
C0805 = smd 1.3 x 1.5: 1 -0.95,0; 2 0.95,0
C2012 = smd 1.3 x 1.5: 1 -0.85,0; 2 0.85,0
153CLV-1010 = smd 4 x 2.5: + 4,0; - -4,0
SMT-JUMPER_2_NC_TRACE_SILK = smd 0.635 x 1.27: 1 -0.508,0; 2 0.508,0
RESC0805_N = smd 1.2 x 1.35: 1 -1.1,0; 2 1,0
1X03 = drill 1.016 pad 1.88: 1 0,0; 2 2.54,0; 3 5.08,0
HRS_DM3CS-SF = smd 0.7 x 2: 1 3.2,-6.35; 2 2.1,-6.35; 3 1,-6.35; 4 -0.1,-6.35; 5 -1.2,-6.35; 6 -2.3,-6.35; 7 -3.4,-6.35; 8 -4.5,-6.35 | smd 2.7 x 1.4: 9 1.8,6.35; S3 -3.1,6.35 | smd 1 x 2.6: S1 -6.6,-5.85 | smd 1.5 x 2.6: S2 6.75,-5.85 | smd 1.2 x 1.2: S5 4.85,6.45
WS2812B-NARROW = smd 1.3 x 1.2: 1-VDD 2.35,-1.65; 2-DOUT 2.35,1.65; 3-GND -2.35,1.65; 4-DIN -2.35,-1.65
MIC_SPH0645LM4H-B_LARGER_RING = smd 0.6 x 0.522: 1 -0.9,2.074; 2 -0.9,1.252; 4 0.9,1.252; 5 0.9,2.074; 6 0,2.074 | drill 1 pad 1.626: P$1 0,0
B2B-PH-K = drill 0.813 square: 1 -1,0 | drill 0.813 octagon: 2 1,0
B3B-PH-K = drill 0.813 square: 1 -2,0 | drill 0.813 octagon: 2 0,0; 3 2,0
S9V11F3S5CMA = drill 0.85: EN 3.81,1.27; PG 1.27,1.27; SEL 1.27,3.81; VIN 6.35,1.27; VOUT 11.43,1.27 | drill 0.85 square: GND 8.89,1.27
R0805 = smd 1.1 x 1.4: 1 -1,0; 2 1,0
M0805 = smd 1.3 x 1.6: 1 -0.95,0; 2 0.95,0
DIPSWITCH-08 = drill 0.97 long: 1 -8.89,-3.81; 2 -6.35,-3.81; 3 -3.81,-3.81; 4 -1.27,-3.81; 5 1.27,-3.81; 6 3.81,-3.81; 7 6.35,-3.81; 8 8.89,-3.81; 9 8.89,3.81; 10 6.35,3.81; 11 3.81,3.81; 12 1.27,3.81; 13 -1.27,3.81; 14 -3.81,3.81; 15 -6.35,3.81; 16 -8.89,3.81
SWITCH_SPDT_PTH_11.6X4.0MM_LOCK = drill 1.016 pad 1.88: 1 0,2.718; 2 0,0; 3 0,-2.718
SHTC3 = smd 0.55 x 0.35: 1 -0.925,0.5; 2 -0.925,-0.5; 3 0.925,-0.5; 4 0.925,0.5 | smd 0.7 x 1.6: 5 0,0
TEENSY_3.0-3.2&LC_DIL = drill 0.965: 0 -7.62,13.97; 1 -7.62,11.43; 2 -7.62,8.89; 3 -7.62,6.35; 3.3V 7.62,11.43; 4 -7.62,3.81; 5 -7.62,1.27; 6 -7.62,-1.27; 7 -7.62,-3.81; 8 -7.62,-6.35; 9 -7.62,-8.89; 10 -7.62,-11.43; 11 -7.62,-13.97; 12 -7.62,-16.51; 13 7.62,-16.51; 14/A0 7.62,-13.97; 15/A1 7.62,-11.43; 16/A2 7.62,-8.89; 17/A3 7.62,-6.35; 18/A4 7.62,-3.81; 19/A5 7.62,-1.27; 20/A6 7.62,1.27; 21/A7 7.62,3.81; 22/A8 7.62,6.35; 23/A9 7.62,8.89; AGND 7.62,13.97; GND -7.62,16.51; VIN 7.62,16.51
3362_BOURNS_TRIMPOT = drill 1: P$1 0,2.54; P$2 -2.54,0; P$3 2.54,0
QFN-32-5X5MM = smd 0.285 x 0.8: 8 1.75,-2.5; 17 1.75,2.5; 19 0.75,2.5; 22 -0.75,2.5; AGND 1.25,-2.5; CPFILT 1.25,2.5; GND2 -1.75,-2.5; GND3 -0.75,-2.5; HP_L 0.75,-2.5; HP_R -1.25,-2.5; HP_VGND -0.25,-2.5; I2S_LRCLK -1.25,2.5; I2S_SCLK -1.75,2.5; SYS_MCLK -0.25,2.5; VDDA 0.25,-2.5; VDDIO 0.25,2.5 | smd 0.8 x 0.285: 9 2.5,-1.75; 28 -2.5,0.25; CTRL_ADR0_CS -2.5,-1.25; CTRL_CLK -2.5,-0.25; CTRL_DATA -2.5,0.75; CTRL_MODE -2.5,-1.75; I2S_DIN -2.5,1.25; I2S_DOUT -2.5,1.75; LINEOUT_L 2.5,-0.25; LINEOUT_R 2.5,-0.75; LININ_L 2.5,0.75; LININ_R 2.5,0.25; MIC 2.5,1.25; MIC_BIAS 2.5,1.75; VAG 2.5,-1.25; VDDD -2.5,-0.75 | smd 3.15 x 3.15: GND1 0,0
SOT-23 = smd 1.016 x 1.143: 1 -0.889,-1.016; 2 0.889,-1.016; 3 0,1.016
VEML7700 = smd 0.7 x 1.6: 1 1.495,-0.4; 2 2.765,-0.4; 3 4.035,-0.4; 4 5.305,-0.4
VISHAY_VEML6030_2X2X0.87 = smd 0.55 x 0.3: 1 -0.875,0.65; 2 -0.875,0; 3 -0.875,-0.65; 4 0.875,-0.65; 5 0.875,0; 6 0.875,0.65

### Placement (x,y rotation side)
AMP  52.76,58.6 270 bottom
BT1  45,70.15 180 bottom
BT2  44.24,20.62 0 bottom
C1  38.24,35.98 270 top
C2  16.99,44.36 0 top
C3  2.07,-3.26 0 top  (outside the outline)
C4  2.07,-9.61 0 top  (outside the outline)
C5  71.48,44.16 0 bottom
C6  33.95,36.1 270 top
C7  71.7,46.96 0 bottom
C8  72.52,34.02 0 top
C9  76,49.31 270 top
C10  68.47,34.03 180 top
C11  9.25,85.75 90 top
C12  9.5,66 90 top
C13  9.5,44.75 90 top
C14  9.5,24.75 90 top
C15  8.5,9.75 0 top
C16  24.75,9.5 180 top
C17  44.24,9.95 180 top
C18  67.15,9.5 180 top
C19  79.75,9.75 0 top
C20  80.5,24.5 270 top
C21  80.5,45 270 top
C22  80.5,65.5 270 top
C23  80.5,80.5 0 top
C24  65.5,80.5 0 top
C25  45,80.75 0 top
C26  24.25,80.5 0 top
C27  59.3,63.59 0 top
C28  59.18,60.9 180 bottom
C29  53.42,66 270 top
C30  9.26,85.44 90 bottom
C31  9.44,44.75 270 bottom
C32  47.89,49.52 270 bottom
C33  59.15,58.84 180 bottom
C34  56.74,50.48 0 bottom
C35  8.42,9.69 180 bottom
C36  45,9.44 180 bottom
C37  79.8,9.69 0 bottom
C38  80.46,45.03 90 bottom
C39  45,80.81 0 bottom
C40  80.56,80.56 0 bottom
C41  -6.31,-5.29 0 top  (outside the outline)
C48  78.86,57.6 180 bottom
C49  67.17,55.41 0 bottom
C50  67.4,57.67 180 bottom
C53  67.38,61.94 180 top
C54  71.7,61.92 180 top
C57  67.4,60.06 0 bottom
C58  59.86,56.61 0 bottom
C59  63.36,58.92 180 bottom
C60  63.36,60.95 180 bottom
DIN  53.31,39.69 90 top
DIN1  26.46,26.2 270 top
DIN2  28.74,26.2 270 top
DOUT  75.86,40.02 0 top
FERRITE1  78.83,59.76 0 bottom
FERRITE2  58.46,58.72 90 top
J1  26.27,47.67 270 top
J2  41.72,61.29 0 top
J3  61.73,42.61 90 top
J4  46.93,27.08 180 top
J5  46.79,40.02 180 top
J6  29.1,47.67 270 top
J7  55.26,18.79 0 top
J8  41.72,64.15 0 top
J9  64.56,42.61 90 top
J10  46.91,29.89 180 top
J11  46.78,42.84 180 top
LED1  3.75,85.75 270 top
LED2  3.5,65.75 270 top
LED3  3.5,45 270 top
LED4  3.5,24.75 270 top
LED5  4.25,3.5 180 top
LED6  24.5,3.5 0 top
LED7  44.24,3.5 0 top
LED8  67.02,3.5 0 top
LED9  85.75,4.25 270 top
LED10  86.5,24.5 90 top
LED11  86.5,45 90 top
LED12  86.5,65.5 90 top
LED13  85.5,86.5 180 top
LED14  65.5,86.5 180 top
LED15  45,86.5 180 top
LED16  24.5,86.5 180 top
LED17  3.73,85.77 270 bottom
LED18  3.47,45 270 bottom
LED19  4.23,3.47 180 bottom
LED20  45,3.47 180 bottom
LED21  85.77,4.23 90 bottom
LED22  86.53,45 90 bottom
LED23  85.51,86.53 0 bottom
LED24  45,86.53 0 bottom
MEMS1  75.38,44.53 0 bottom
MIC1  34.08,45 270 top
MIC2  44.24,55.21 180 top
MIC3  55.16,45 90 top
MIC4  44.24,34.59 0 top
MIC5  44.01,48.17 0 top
NEO_PIX2  68.53,45.18 90 top
PWR_REG  11.52,38.16 90 bottom
R1  70.91,27 180 top
R2  75.27,49.37 90 bottom
R3  63.47,33.01 270 top
R4  60.88,32.96 270 top
R5  55.71,66 270 top
R9  78.86,55.44 0 bottom
R11  62.65,28.36 0 top
S1  35.14,18.94 0 top
S2  22.35,45.05 0 top
U2  73.46,48.56 270 top
U$3  59.6,44.97 270 bottom
U$4  23.38,34.19 90 top
U$6  22.62,56.58 90 top
U$8  72.89,57.6 90 bottom
U$9  63.52,55.97 180 bottom
VEML1  74.97,31.5 180 top
VMEL1  71.62,29.77 0 top

### Tracks (layer width: path | path; a pad name or v marks a point on that pad's centre or on a via)
3.3V  (via drill 0.51, 0.55, 0.7)
  Top 0.305: R11.2 65.6,28.36 | 65.6,28.36 v65.65,28.41 | v65.57,31.79 63.74,31.79 R3.2 63.42,32.01 R4.2 60.15,31.28 v54.91,31.28 v54.91,32.55 | U2.1 74.74,50.26 C9.1 | R1.2 66.97,27 65.6,28.36 | J7.4 55.16,15.21 v54.98,15.38
  Top 0.508: U$4.P$2 v27.21,35.48 v27.22,35.48 | v54.91,32.55 52.52,34.94 48.95,34.94 48.31,35.58 48.31,37.2 U$3.3.3V 46.99,38.52 46.21,38.52 46.14,38.59 45.11,38.59 45.09,38.57 43.62,38.57 43.6,38.59 42.57,38.59 42.2,38.22 31.59,38.22 30.78,39.03 v30.75,39.01 | C9.1 77.09,51.35 v77.77,51.35 | v77.56,38.24 77.59,38.27 77.59,39.53 77.54,39.58 77.54,40.62 77.59,40.67 v77.59,41.16
  Bottom 0.305: v65.65,28.41 65.57,28.49 v65.57,31.79 | MEMS1.5 73.01,46.6 C7.1 72.41,46.72 72.41,45.22 72.43,45.2 C5.1 | C60.1 62.41,63.68 62.27,63.82 | v54.98,15.38 55.13,15.54 55.13,31.05 v54.91,31.28
  Bottom 0.508: v27.22,35.48 v30.75,39.01 | 79.09,51.15 79.06,51.12 79.06,47.51 78.83,47.28 78.83,42.26 77.59,42.26 | 79.09,51.15 81.58,53.64 81.58,59.99 | 81.58,59.99 80.16,59.99 FERRITE1.1 | 79.09,51.15 78.88,51.35 v77.77,51.35 | 81.58,59.99 77.74,63.82 62.27,63.82 | v77.56,38.24 77.56,34.26 75.76,32.45 67.71,32.45 66.69,33.47 66.69,33.82 66.34,34.18 65.98,34.18 65.3,34.87 55.64,34.87 55.23,34.46 55.23,33.99 54.91,33.66 v54.91,32.55 | 77.59,42.26 v77.59,41.16 | 77.59,42.26 74.33,42.26 C5.1
  Bottom 0.635: C59.1 62.53,58.76 | 62.53,58.76 C60.1 | C58.1 62.25,56.61 U$9.1 62.53,57.09 62.53,58.76
5V  (via drill 0.35, 1)  (7 unrouted)
  Top 0.305: C27.1 58.36,63.57 58.31,63.52 58.31,62.78 | v54.53,63.41 54.47,63.37 | v54.53,63.41 54.47,63.34 | v50.97,62.66 52.01,62.66 52.49,62.17 53.26,62.17 53.79,62.71 54.52,62.71 | v54.53,63.41 54.48,62.76 54.52,62.71 | v58.31,62.14 58.31,62.78 | v51.02,54.3 51.15,54.3 51.73,53.71 54.05,53.71 v54.56,54.23 54.84,54.23 55.34,54.73 56.04,54.73 57.06,53.71 v57.06,53.68 | 58.31,62.78 58.24,62.71 54.52,62.71
  Top 1.27: PWR_REG.VOUT 22.65,49.59 | 22.65,49.59 23.65,49.59 24.15,49.09 24.15,40.71 32.05,32.81 35.86,32.81 | LED12.1-VDD 85.87,65.57 83.1,65.57 82.22,66.45 C22.1 80.5,76.56 79.54,77.51 C23.1 | LED10.1-VDD 85.73,24.43 84.12,24.43 83.09,25.45 C20.1 78.81,25.45 78.8,25.44 | LED8.1-VDD 67.47,3.76 67.47,6.83 68.1,7.47 C18.1 68.35,9.75 C19.1 | LED7.1-VDD 45,3.44 45,5.35 | LED6.1-VDD 24.43,4.27 24.43,6.77 25.7,8.05 C16.1 25.29,9.91 25.29,10.6 21.36,14.52 7.55,14.52 | LED4.1-VDD 3.88,24.43 6.14,24.43 6.9,23.66 9.36,23.66 C14.1 9.64,23.66 12.23,23.66 | LED3.1-VDD 4.2,45 5.88,45 v6.8,44.09 7.08,43.8 C13.1 10.76,43.8 11.09,43.48 | LED2.1-VDD 4.02,65.57 6.39,65.57 6.92,65.05 C12.1 12.79,61.76 | LED1.1-VDD 2.1,83.91 3.64,85.45 v6.97,85.45 6.97,85.32 8.8,83.48 | 8.8,83.48 13,79.29 | C11.1 9.25,83.93 8.8,83.48 | 13,79.29 14.21,80.5 C26.1 23.28,80.52 23.28,82.21 24.43,83.35 24.43,85.87 LED16.1-VDD | LED14.1-VDD 65.57,85.73 65.57,83.23 64.55,82.2 C24.1 64.55,79.03 64.43,78.91 | LED15.1-VDD 45,85.8 45,83.1 44.75,82.85 | C23.1 69.03,80.5 67.45,78.91 64.43,78.91 | C23.1 79.54,84.54 LED13.1-VDD | LED5.1-VDD 6.5,9.75 C15.1 7.55,14.52 | LED9.1-VDD v79.83,6.17 78.8,7.2 C19.1 | 35.86,36.98 C1.+ 41.24,36.98 | 35.86,36.98 33.98,36.98 C6.1 | 7.55,14.52 7.55,18.98 12.23,23.66 | 12.23,23.66 12.23,36.62 11.09,37.76 11.09,43.48 | 11.09,43.48 11.09,47.89 11.76,48.57 11.77,48.57 PWR_REG.VOUT | 12.79,61.76 PWR_REG.VOUT | 12.79,61.76 16.68,65.66 16.68,75.6 13,79.29 | PWR_REG.VOUT 12.87,49.68 12.87,55.08 36.71,78.91 43.86,78.91 | 43.86,78.91 64.43,78.91 | 43.86,78.91 44.05,79.1 C25.1 44.05,82.15 44.75,82.85
  Top 1.27: C19.1 78.8,16.81 | 78.8,16.81 78.8,25.44 | 78.8,42.46 78.8,43.16 78.72,43.24 78.72,45.95 C21.1 82.78,45.95 83.73,45 85.8,45 LED11.1-VDD 86.4,45.6 v86.4,45.51 | 48.86,20.51 48.86,30.8 46.83,32.83 38.04,32.83 38.02,32.81 35.86,32.81 | 48.86,20.51 48.86,20.5 70.26,20.5 73.96,16.81 78.8,16.81 | U$3.VIN 42.72,36.98 41.24,36.98 | 41.19,36.92 41.24,36.98 | 35.86,32.81 35.86,36.98 | 48.86,20.51 46.52,18.18 46.52,13 45.01,11.48 45.01,10.13 C17.1 45.25,9.88 45,9.63 45,5.35 | v80.46,42.45 78.81,42.45 78.8,42.46 | NEO_PIX2.1 71.54,40.17 v73.7,40.17 | 78.8,25.44 78.8,37.62 78.88,37.7 78.88,38.79 78.8,38.87 v78.8,40.1 79.42,40.72 79.42,41.66 78.8,42.28 78.8,42.46 | v44.87,5.22 45,5.35 | v44.75,82.87 44.75,82.85 | U$6.P$2 22.62,49.62 22.65,49.59
  Bottom 0.305: 58.2,50.43 57.95,50.43 57.13,50.43 57.13,50.48 | 57.13,50.48 C34.1 | AMP.13 56.34,55.79 56.34,54.4 v57.06,53.68 | 58.23,60.47 C28.1 58.23,62.06 v58.31,62.14 58.31,57.93 56.56,56.18 | AMP.9 54.39,61.41 54.39,62.96 54.4,62.95 54.4,63.33 v54.53,63.41 | 54.38,55 AMP.16 54.38,54.49 54.56,54.31 v54.56,54.23 | 57.13,54.22 57.13,50.48 | AMP.21 51.1,55.77 51.1,54.91 51.02,54.83 v51.02,54.3 | AMP.4 51.14,61.41 51.14,62.2 50.97,62.37 v50.97,62.66
  Bottom 0.635: 56.43,56.38 56.43,54.96 57.04,54.34 57.04,51.12 C34.1 | C33.1 58.2,60.44 58.23,60.47
  Bottom 0.762: NEO_PIX2.1 66.34,45.38 66.34,48.81 64.81,50.33 58.05,50.33 57.95,50.43
  Bottom 1.27: LED19.1-VDD 7.47,6.01 C35.1 6.44,9.69 v5.88,9.13 | LED20.1-VDD 47.25,5.22 v44.87,5.22 44.87,7.93 44.46,8.34 44.46,9.03 C36.1 | C39.1 45.95,81.58 LED24.1-VDD | v81.78,86.78 83.16,85.4 LED23.1-VDD 83.16,83.85 81.48,82.16 81.48,80.59 C40.1 | v86.4,45.51 84.88,47.03 LED22.1-VDD | LED21.1-VDD 82.43,8.27 | 82.43,8.27 81.01,9.69 C37.1 | 82.43,8.27 81.93,8.27 v79.83,6.17 79.8,6.14 | C38.1 80.48,44.05 80.48,42.47 v80.46,42.45 | v73.7,40.17 76.72,40.17 77.04,39.85 78.7,39.85 78.71,39.84 78.8,39.94 v78.8,40.1 | LED17.1-VDD 5.85,83.42 6.97,84.53 v6.97,85.45 7.93,84.49 C30.1 | LED18.1-VDD 5.48,42.65 8.53,45.7 C31.1
_BUT1  (1 unrouted)
  Top 0.203: S1.16 26.25,25.7
_BUT2  (1 unrouted)
  Top 0.203: 28.77,25.64 28.77,25.06 28.8,25.04 S1.15
AGND  (via drill 0.6)  (24 unrouted)
  Top 0.787: 57.29,64.88 57.29,66.03 56.38,66.95 R5.1 C29.1 52.08,68.29 39.79,68.29 29.18,57.67 v29.18,57.65 | AMP.EXP@16 69.12,59.9 v69.79,60.57
  Bottom 0.305: U$8.AGND 69.84,58.85 69.58,59.11 69.58,60.37 v69.79,60.57 | 49.97,58.6 AMP.EXP@8 | 49.18,56.98 AMP.EXP@3 | 49.18,60.23 AMP.EXP@1
  Bottom 0.787: v57.28,64.94 57.4,64.82 57.4,62.5 56.47,61.56 56.47,61.28 | v29.18,57.65 26.66,55.13 | 26.66,55.13 24.12,52.59 24.12,37.46 U$4.P$3 | U$6.P$3 22.68,59.12 26.66,55.13 | 56.47,61.28 56.46,61.27 | 56.47,61.28 56.47,60.36 AMP.EXP@16
AUDIO_LEFT+
  Bottom 0.508: AMP.5 51.78,63.1 49.26,65.62 40.74,65.62 39.67,64.55 39.67,61.31 | 39.67,61.31 39.67,60.73 39.59,60.73 | J1.1 26.27,48.44 38.57,60.73 39.59,60.73 | J3.1 61.61,42.73 51.9,42.73 | 49.48,42.71 49.53,42.71 49.59,42.77 51.9,42.77 51.9,42.73 | 49.48,42.71 49.53,42.77 48.86,42.77 46.5,45.13 40.43,45.13 39.59,45.97 39.59,60.73 | 49.48,42.71 J5.1 | J2.1 39.68,61.29 39.67,61.31 | 51.9,42.73 51.9,32.33 47.62,28.05 47.62,27.77 J4.1
AUDIO_LEFT-  (via drill 0.65, 0.7)  (2 unrouted)
  Top 0.508: v29.1,52.8 J6.1 | v37.38,61.76 38.6,60.55 v38.6,59.35 | v40.68,62.73 37.94,62.73 v37.38,63.29 | J11.1 46.78,42.71 49.41,40.08 49.41,39.59 | 49.41,36.1 49.41,39.59 51.6,41.78 v52.92,41.78
  Bottom 0.508: AMP.8 53.72,61.42 53.72,63.43 50.81,66.34 40.43,66.34 v37.38,63.29 v37.38,61.76 37.38,60.63 29.55,52.8 v29.1,52.8 | v38.6,59.35 38.73,59.35 38.88,59.2 38.88,45.67 40.18,44.37 46.25,44.37 47.12,43.5 47.12,43.18 J11.1 | v49.37,36.06 49.37,32.35 J10.1 | v52.92,41.78 60.58,41.78 61.15,41.22 63.16,41.22 J9.1 | J8.1 40.68,63.11 v40.68,62.73
AUDIO_RIGHT+  (via drill 0.6)
  Top 0.508: v40.71,46.42 37.48,43.2 37.48,42.37 37.64,42.21 | 37.64,42.21 39.84,40.02 J5.3 | 37.64,42.21 37.64,42.14 37.57,42.14 v36.46,41.03
  Bottom 0.508: J4.3 41.85,27.79 40.43,29.21 40.43,30.72 41.11,31.41 41.11,37.1 37.99,40.23 37.97,40.23 37.16,41.03 v36.46,41.03 35.62,41.88 30.36,41.88 29.68,41.19 27.67,41.19 J1.3 | J2.3 45.41,59.9 42.13,59.9 40.46,58.22 40.46,53.27 40.48,53.25 40.48,46.65 | 40.48,46.65 41.27,45.86 49.06,45.86 | 40.48,46.65 40.48,46.42 v40.71,46.42 | J3.3 61.42,47.69 60.87,47.14 51.92,47.14 50.64,45.86 49.06,45.86 | 49.06,45.86 49.27,46.08 49.27,47.35 51.9,49.98 51.9,53.08 51.81,53.17 51.81,55.78 AMP.20
AUDIO_RIGHT-  (via drill 0.6, 0.7)  (1 unrouted)
  Top 0.508: v50.28,46.93 49.53,46.93 47.1,49.36 42.14,49.36 41.82,49.05 41.82,46.03 38.55,42.77 v38.47,42.77
  Bottom 0.508: J6.3 36.62,42.59 | 36.62,42.59 38.29,42.59 v38.47,42.77 38.53,42.71 41.57,42.71 J11.3 | J8.3 46.8,63.27 48.2,61.87 48.2,60.72 46.67,59.19 42.42,59.19 41.17,57.93 41.17,53.56 41.19,53.54 41.19,47.56 v41.83,46.93 | v50.28,46.93 52.01,48.66 | J9.3 63.7,47.69 62.3,49.09 61.15,49.09 59.91,47.85 52.82,47.85 52.01,48.66 | AMP.17 53.73,54.58 53.73,54.57 53.73,53.79 54.44,53.08 54.44,51.09 52.01,48.66 | 36.62,42.59 38.27,40.94 38.28,40.94 41.83,37.39 J10.3
BCLK  (via drill 0.35)
  Top 0.203: U$3.9 69.56,53.66 74.69,53.66 75.45,54.42 v76.04,54.42 | v73.19,45.54 72.36,46.38 72.36,47.46 70.55,49.27 v68.37,49.27
  Bottom 0.203: v76.04,54.42 76.04,55.2 U$8.I2S_SCLK | MEMS1.4 74.24,45.54 v73.19,45.54 | v68.37,49.27 68.37,52.47 U$3.9
BUT1  (via drill 0.35)  (1 unrouted)
  Top 0.203: U$3.0 44.44,52.59 44.13,52.27 44.13,52.15 43.52,51.54 42.59,51.54 42.48,51.64 38.72,51.64 38.69,51.68 37.49,51.68 37.46,51.64 36.57,51.64 36.57,45.89 35.09,44.42 35.09,43.65 34.38,42.94 34.38,40.66 v34.05,40.33 | v30.65,31.31 26.48,27.14 26.46,27.14 26.03,26.71
  Bottom 0.203: v34.05,40.33 34.05,34.81 30.65,31.41 v30.65,31.31
BUT2  (via drill 0.35)
  Top 0.203: U$3.1 47.11,51.53 44.08,51.53 43.69,51.14 42.42,51.14 42.32,51.24 38.55,51.24 38.52,51.27 37.66,51.27 37.63,51.24 36.97,51.24 36.97,44.93 36.23,44.93 35.53,44.22 35.53,43.51 35.09,43.08 35.09,42.85 34.79,42.54 34.79,39.62 v34.71,39.54 | DIN2.1 28.74,27.98 v32.05,31.28
  Bottom 0.203: v32.05,31.28 34.71,33.95 v34.71,39.54
BUT3  (via drill 0.35)
  Top 0.203: U$3.4 55.06,51.86 54.71,51.86 53.89,51.04 44.16,51.04 43.85,50.73 42.25,50.73 42.15,50.83 38.38,50.83 38.35,50.87 37.83,50.87 37.8,50.83 37.38,50.83 37.38,43.98 35.6,42.21 35.6,40.58 v36.36,39.82 | S1.14 37.31,28.73 37.31,30.71 38.4,31.79 v38.52,31.66
  Bottom 0.203: v38.52,31.66 37.63,32.55 37.63,34.2 37.26,34.57 37.26,38.92 v36.36,39.82
BUT4  (via drill 0.35)
  Top 0.203: U$3.6 60.06,51.78 60.03,51.78 56.18,47.93 56.18,42.21 53.62,42.21 53.25,42.57 51.6,42.57 50.23,41.2 49.46,41.2 v49.46,41.24 | v35.6,25.7 34.89,25.7 33.88,24.68 S1.13
  Bottom 0.203: v49.46,41.24 49.46,40.18 47.07,37.8 47.07,37.32 45.3,35.55 44.84,35.55 44.27,34.99 44.27,31.55 43.12,30.4 43.12,26.36 42.46,25.7 v35.6,25.7
BUT5  (via drill 0.35)
  Top 0.203: v54.37,27.3 54.37,29.51 54.91,30.04 66.06,30.04 v66.34,29.76 | v65.85,33.34 65.85,34.61 66.72,35.48 v70.91,35.48
  Bottom 0.203: S1.12 38.8,20.36 43.06,20.36 43.27,20.16 44.8,20.16 45.01,20.36 47.29,20.36 54.22,27.3 v54.37,27.3 | v65.85,33.34 65.85,32.84 66.34,32.36 v66.34,29.76 | v70.91,35.48 70.93,35.5 70.93,37.25 U$3.15/A1
BUT6  (via drill 0.35)
  Top 0.203: v54.4,34.33 54.4,37.48 55.57,38.65 v55.57,39.51
  Bottom 0.203: S1.11 40.84,20.87 43.13,20.87 43.43,20.56 44.63,20.56 44.94,20.87 47.03,20.87 53.99,27.83 53.99,29.93 54.04,29.98 54.04,32.17 54.02,32.19 54.02,32.92 54.14,33.04 54.14,34.08 v54.4,34.33 | v55.57,39.51 66.32,39.51 U$3.16/A2
BUT7
  Bottom 0.203: U$3.20/A6 57.6,36.62 56.53,36.62 56.22,36.3 55.48,36.3 53.62,34.45 53.62,32.02 53.64,32 53.64,30.15 53.59,30.1 53.59,28.18 46.68,21.28 44.77,21.28 44.47,20.97 43.6,20.97 42.43,22.14 41.7,22.14 41.49,22.34 S1.10
BUT8
  Bottom 0.203: S1.9 44.03,23.71 44.24,23.92 48.56,23.92 53.18,28.54 53.18,30.27 53.23,30.32 53.23,31.84 53.21,31.85 53.21,34.77 U$3.21/A7
BYPASS
  Bottom 0.203: AMP.22 50.38,55.7 50.38,54.14 49.87,53.63 47.73,53.63 47.12,53.02 47.12,51.35 47.89,50.59 C32.1
COSC  (via drill 0.35)  (1 unrouted)
  Top 0.203: v55.41,63.39 55.41,63.44 53.81,65.05
  Bottom 0.203: v55.41,63.39 55.03,63.01 AMP.10
DIN  (1 unrouted)
  Top 0.203: U$3.22/A8 53.25,38.91 52.98,39.18
DOUT  (via drill 0.35)  (1 unrouted)
  Top 0.203: v77.33,49.12 77.33,48.58 77.08,48.33 77.08,47.77 77.26,47.59 77.26,42.54 75.3,40.58 | DOUT.1 75.35,38.1 U$3.13
  Bottom 0.203: v77.33,49.12 77.05,49.12 75.8,50.32 R2.2
EDITROUTE  (via drill 0.35)  (1 unrouted)
  Top 0.203: v69.33,55.13 73.12,55.13 v76.62,58.64
  Bottom 0.203: U$8.VDDIO 77.66,57.85 C48.1 76.87,58.64 v76.62,58.64 77.74,59.76 FERRITE1.2 | 72.14,54.21 72.13,54.2 70.26,54.2 69.33,55.12 v69.33,55.13 68.4,55.13 C49.1
  Bottom 0.305: C48.1 77.91,59.68 FERRITE1.2
GND  (via drill 0.35)  (1 unrouted)
  Top 0.203: U2.5 73.96,48.56 | 73.96,48.56 75.8,48.56 C9.2 | U2.4 73.96,48.56 | VMEL1.1 70.94,30.61 VEML1.3 70.68,32.15 70.68,33.06 70.28,33.06 | 70.91,28.24 71.32,28.65 71.32,30.04
  Top 1.27: LED16.3-GND 26.85,82.15 C26.2 | LED15.3-GND 47.35,82.15 C25.2 | LED14.3-GND 67.85,81.9 C24.2 | LED10.3-GND 81.9,22.15 C20.2 | LED12.3-GND 81.9,63.15 C22.2 | LED1.3-GND 7.85,88.1 C11.2 | LED2.3-GND 8.35,68.1 C12.2 | LED3.3-GND 7.85,47.35 C13.2 | LED4.3-GND 8.1,27.1 C14.2 | LED5.3-GND 9.45,4.7 C15.2 | LED6.3-GND 22.15,7.85 C16.2 | LED7.3-GND 41.89,8.55 C17.2 | LED8.3-GND 64.67,7.97 C18.2 | S1.1 S1.2 S1.3 S1.4 S1.5 S1.6 S1.7 S1.8 | PWR_REG.GND 16.99,47.05 C2.- 21.46,46.87 S2.1 | LED11.3-GND 82.15,42.65 82.15,43.1 81.22,44.03 80.52,44.03 C21.2 | U$3.GND 39.11,52.59 39.08,52.62 35.86,52.62
  Bottom 0.203: AMP.18 AMP.19 | AMP.6 AMP.7 | U$8.GND3 71.67,56.85 | 71.67,56.85 72.43,56.85 72.85,56.85 | 71.64,56.43 71.64,56.82 71.67,56.85
  Bottom 0.305: U$3.GND 44.08,52.59 45.17,53.68 46.56,53.68 47.38,54.49 47.87,54.49 | C50.2 69.18,56.85 U$8.GND3 72.43,56.85 | 71.64,56.43 U$8.CTRL_ADR0_CS U$8.CTRL_MODE U$8.GND2
  Bottom 2.54: BT2.GND@1 7.42,20.63 7.41,20.62 13.6,20.62 BT2.GND@1 | BT2.GND@1 13.61,28.34 13.76,28.49 13.76,20.77 BT2.GND@1 | BT2.GND@1 13.61,13.61 13.25,13.25
  other vias: 68.37,82.85 69.38,82.85 70.4,82.85 68.88,82.08 69.89,82.08 83.46,81.27 82.97,82.01 85.89,82.85 83.86,82.08 83.86,11.73 83.86,10.71 83.05,11.17 88.18,11.73 88.18,10.71 88.87,11.19 86.66,82.85 86.35,81.96 79.8,87.16 79.16,86.58 78.71,87.44 12.64,84.78 14.27,85.64 14.77,84.88 13.25,84.12 13.91,83.43 16.04,79.04 17.06,79.04 18.08,79.04 16.55,78.27 17.57,78.27 52.77,62.86 51.98,64.05 51.22,64.79 48.53,64.53 46.32,67.22 47.34,67.22 48.35,67.22 46.32,69.26 47.34,69.26 48.35,69.26 32.6,69.26 33.62,69.26 34.64,69.26 32.6,65.45 33.62,65.45 34.64,65.45 61.46,64.96 62.48,64.96 63.49,64.96 64.51,64.96 65.52,64.96 67.68,29.81 68.7,29.81 68.7,28.79 52.9,54.4 27.52,53 26.51,53 27.04,51.76 40.22,35.73 39.46,35.73 53.66,48.81 54.68,48.81 55.69,48.81 29.3,39.28 28.29,39.28 28.79,38.27 50.05,19.17 51.32,19.17 52.59,19.17 52.59,18.15 51.32,18.15 50.05,18.15 59.71,19.17 60.98,19.17 60.98,18.15 59.71,18.15 15.46,84.24 69.38,56.07 64.81,54.91 80.05,47.51 80.94,47.51 80.94,48.53 80.05,48.51 61.21,57.95 65.5,58.87
  pour Top: -0.01,90.06 -0.01,0.09 90.31,0.09 90.31,90.06
  pour Top: 0.04,89.93 89.96,89.93 89.96,0.04 0.04,0.04
  pour Bottom: 0.04,90.03 89.96,90.03 89.96,0.04 0.04,0.04
LINN  (1 unrouted)
LOUT_L  (via drill 0.35)
  Top 0.508: C53.2 60.19,61.94 59.05,60.8 51.48,60.8 v49.55,62.73
  Bottom 0.203: AMP.2 49.83,62.52 49.62,62.73 v49.55,62.73
LOUT_R  (via drill 0.45)  (1 unrouted)
  Top 0.508: C54.2 70.75,60.08 67.07,56.41 50.56,56.41 49.7,55.54 v49.7,54.42
  Bottom 0.203: AMP.23 49.83,55.04
  Bottom 0.508: v49.7,54.42 49.7,54.47 49.82,54.59 AMP.23
LRCLK  (via drill 0.35)
  Top 0.203: v76.39,55.81 76.25,55.81 74.5,54.07 63.41,54.07 62.36,53.02 62.36,52.61 61.13,51.38 60.2,51.38 56.58,47.76 56.58,42.04 55.38,40.83 52.44,40.83 50.71,39.1 U$3.23/A9
  Bottom 0.203: U$8.I2S_LRCLK 75.86,56.35 76.09,56.12 76.09,56.11 v76.39,55.81 76.95,55.25 76.95,54.51 77.15,54.32 77.15,52.15 76.93,51.93 76.93,51.09 77.48,50.54 77.63,50.54 78.17,49.99 78.17,49.82 78.42,49.57 78.42,48.36 78.45,48.33 78.45,47.77 78.17,47.49 78.17,47.09 77.68,46.6 MEMS1.1
MCLK  (via drill 0.35)
  Top 0.203: U$3.11 74.23,53.26 74.86,53.26 75.34,53.74 79.04,53.74 v79.04,53.76
  Bottom 0.203: v79.04,53.76 79.81,54.53 R9.1
MISO  (via drill 0.35)  (1 unrouted)
  Top 0.203: U$3.12 75.04,52.59 73.59,51.14 63.23,51.14 63.22,51.12 62.6,51.12 61.63,50.16 60.7,50.16 57.8,47.25 57.8,41.53 57.7,41.43 57.7,39.45 59.37,37.78 59.37,36.69 58.64,35.95 v58.64,32.79 | v57.12,17.14 53.64,17.14 51.86,15.36
  Bottom 0.203: v58.64,32.79 58.64,28.7 58.71,28.62 58.71,18.23 57.62,17.14 v57.12,17.14
MOSI  (via drill 0.35)
  Top 0.203: v56.3,15.41 56.3,12.48 J7.3 | v56.43,32.79 56.84,32.79 56.84,41.72 56.99,41.87 56.99,47.59 60.37,50.97 61.3,50.97 62.26,51.93 62.75,51.93 U$3.7
  Bottom 0.203: v56.43,32.79 56.43,15.54 v56.3,15.41
N$1
  Bottom 0.203: MEMS1.6 75.38,48.3 R2.1
N$2
  Bottom 0.508: MIC1.1 32.74,46 29.68,49.06 28.52,49.06 27.7,48.25 27.7,46.57 J1.2
N$3  (via drill 0.7)
  Top 0.508: J2.2 45.2,60.35 v45.2,58.18
  Bottom 0.508: v45.2,58.18 45.2,55.25 MIC2.1
N$4
  Top 0.203: VMEL1.6 72.21,30.7 72.21,31.47 | 72.21,31.47 VEML1.2 72.08,32.03 72.08,33.51 C8.1 69.43,34.02 C10.1 | R1.1 71.91,28.23 71.91,31.17 72.21,31.47 | 72.21,31.47
N$5
  Top 0.203: PWR_REG.EN 19.27,41.97 S2.2
N$6
  Bottom 0.508: MIC3.1 60.57,44 J3.2
N$7  (via drill 0.7)
  Top 0.508: J4.2 42.98,28.49 41.12,28.49 40.43,29.18 40.43,30.52 v39.62,31.34 | v39.8,34.2 40.19,34.59 MIC4.1
  Bottom 0.508: v39.62,31.34 39.62,34 39.8,34.19 v39.8,34.2
N$8
  Top 0.508: J5.2 42.82,41.44 41.12,41.44 40.3,42.26 40.3,43.42 43.01,46.13 MIC5.1
N$9
  Top 0.203: LED1.2-DOUT 5.4,71.65 LED2.4-DIN
N$10
  Top 0.203: LED2.2-DOUT 5.15,50.65 LED3.4-DIN
N$11
  Top 0.203: LED3.2-DOUT 5.15,30.4 LED4.4-DIN
N$12  (via drill 0.51)  (1 unrouted)
  Top 0.203: LED4.2-DOUT 5.15,10.48 v5.12,10.46 | v4.61,5.12 6.57,5.12
  Bottom 0.203: v5.12,10.46 5.12,9.87 4.83,9.57 4.83,5.34 v4.61,5.12
N$13  (via drill 0.35)
  Top 0.203: LED5.2-DOUT 3.88,1.85 v5.12,3.09 | v19.6,2.58 21.42,2.58 LED6.4-DIN
  Bottom 0.203: v5.12,3.09 7.41,3.09 7.92,2.58 v19.6,2.58
N$14
  Top 0.203: LED7.2-DOUT 61.37,5.15 LED8.4-DIN
N$15  (via drill 0.51)
  Top 0.203: LED8.2-DOUT 78.5,5.15 v78.53,5.12 | v82.34,6.14 82.8,6.6 LED9.4-DIN
  Bottom 0.203: v78.53,5.12 79.39,5.12 81.31,5.12 v82.34,6.14
N$16
  Top 0.203: LED9.2-DOUT 87.4,4.92 86.4,5.92 86.4,20.4 LED10.4-DIN
N$17
  Top 0.203: LED10.2-DOUT 84.85,39.35 LED11.4-DIN
N$18
  Top 0.203: LED11.2-DOUT 84.85,59.85 LED12.4-DIN
N$19  (via drill 0.51)
  Top 0.203: LED13.2-DOUT 82.11,84.85 82.08,84.88 v81.83,84.62 | v78.58,85.69 76.12,88.15 LED14.4-DIN
  Bottom 0.203: v81.83,84.62 80.56,85.89 78.78,85.89 v78.58,85.69
N$20
  Top 0.203: LED14.2-DOUT 50.65,84.85 LED15.4-DIN
N$21
  Top 0.203: LED15.2-DOUT 30.15,84.85 LED16.4-DIN
N$22
  Bottom 2.54: BT2.PWR@1 82.77,28.51 82.77,50.49 84.29,52.01 84.29,61.15 75.63,69.82 BT1.GND@1
N$23
  Top 0.203: LED13.4-DIN 84.85,85.15 84.85,80.02 LED12.2-DOUT
N$24
  Top 0.203: LED6.2-DOUT 38.59,5.15 LED7.4-DIN
N$25
  Bottom 0.508: J6.2 30.23,44 MIC1.2
N$26
  Bottom 0.203: LED18.2-DOUT 1.82,5.18 LED19.4-DIN
N$27  (via drill 0.45)
  Top 0.305: v69.51,62.04 69.41,61.94 C53.1
  Bottom 0.305: U$8.LINEOUT_R 72.14,61.04 71.14,62.04 v69.51,62.04
N$28  (via drill 0.45)
  Top 0.508: v73.8,62.02 73.7,61.92 C54.1
  Bottom 0.305: U$8.LINEOUT_L 72.64,60.85 v73.8,62.02
N$29
  Bottom 0.203: LED19.2-DOUT 39.35,1.82 LED20.4-DIN
N$30
  Bottom 0.203: LED20.2-DOUT 84.06,1.82 LED21.4-DIN
N$31
  Bottom 0.203: LED22.4-DIN 87.42,40.11 LED21.2-DOUT
N$32
  Top 0.508: MIC2.2 45.19,57.16 45.62,57.16 48.2,59.74 48.2,61.87 47.38,62.69 45.72,62.69 J8.2
N$33
  Bottom 0.203: LED22.2-DOUT 88.18,84.56 LED23.4-DIN
N$34
  Bottom 0.203: U$8.VAG 71.64,60.88 71.16,61.36 69.49,61.36 68.35,60.23 C57.1
N$35  (via drill 0.35)
  Top 0.203: DIN.2 56.18,40.2 v56.18,40.17 | v73.91,50.58 73.91,50.73 63.43,50.73 63.41,50.71 62.76,50.71 61.8,49.75 60.87,49.75 58.21,47.08 58.21,41.36 58.11,41.26 58.11,40.85 58.76,40.2 v58.79,40.2
  Bottom 0.203: v56.18,40.17 58.54,40.17 58.64,40.07 58.66,40.07 v58.79,40.2 | U$8.I2S_DIN 74.14,53.48 74.61,53.02 74.61,52.1 73.91,51.4 v73.91,50.58
N$36  (via drill 0.35)
  Top 0.203: DOUT.2 76.37,41.05 77.77,42.45 v77.77,48.05
  Bottom 0.203: U$8.I2S_DOUT 74.64,53.56 75.05,53.15 75.05,52.06 75.69,51.42 76.05,51.42 76.38,51.09 76.38,51.02 77.31,50.08 77.51,50.08 77.77,49.83 77.77,49.65 78.02,49.4 78.02,48.83 77.77,48.58 v77.77,48.05
N$37
  Bottom 0.203: LED23.2-DOUT 50.65,88.18 LED24.4-DIN
N$38
  Bottom 0.203: U$8.SYS_MCLK 76.09,57.35 77.91,55.53 R9.2
N$39  (1 unrouted)
  Bottom 0.305: U$9.2 65.77,56.99 C50.1 67.35,58.57 67.56,58.78 69.15,58.78 69.41,58.52 69.41,58.29 69.84,57.85 70.39,57.85
N$40  (via drill 0.7)
  Top 0.508: J9.2 63.12,43.72 63.12,42.03 62.3,41.22 61.15,41.22 60.33,42.03 60.33,46 v60.25,46.08
  Bottom 0.508: v60.25,46.08 55.24,46.08 MIC3.2
N$42
  Bottom 0.508: J10.2 45.24,30.76 MIC4.2
N$43
  Bottom 0.203: LED17.2-DOUT 5.12,80.37 LED18.4-DIN
N$44
  Top 0.508: J11.2 44.26,42.84 45.01,43.6 MIC5.2
NEO_PIX1  (via drill 0.35)
  Top 0.203: 2.17,88.03 LED1.4-DIN
  Top 0.305: v35.7,60.29 35.8,60.29 v37.89,58.21 | U$3.5 57.13,51.39 54.89,51.39 54.05,50.55 44.35,50.55 44.07,50.27 38.13,50.27 v38.09,50.23 | v3.85,87.67 2.53,87.67 2.17,88.03
  Bottom 0.305: v38.09,50.23 38.27,50.41 38.27,57.83 v37.89,58.21 | v35.7,60.29 35.7,72.58 25.19,83.1 15.46,83.1 10.89,87.67 6.68,87.67 6.12,87.11 4.63,87.11 4.07,87.67 v3.85,87.67
NEO_PIX1_OUT  (via drill 0.51)
  Top 0.203: v12.42,88.12 18.88,88.12 LED16.2-DOUT
  Bottom 0.203: LED17.4-DIN 6.13,88.12 6.14,88.13 11.08,88.13 11.09,88.12 v12.42,88.12
NEO_PIX2
  Bottom 0.203: NEO_PIX2.2 67.62,45.18 67.02,45.78 67.02,49.09 65.95,50.17 U$3.8
POT1
  Bottom 0.508: U$3.17/A3 64.56,38.73 55.48,38.73 54.44,37.69 54.44,36.85 52.62,35.03 52.62,28.83 48.48,24.69 27.65,24.69 20.84,31.49 U$4.P$1
RINN  (1 unrouted)
ROSC  (via drill 0.35)
  Top 0.203: v56.33,63.39 56.33,64.43 R5.2
  Bottom 0.203: AMP.11 55.67,61.42 55.67,62.73 v56.33,63.39
SCL  (via drill 0.35, 0.51)
  Top 0.203: VMEL1.5 72.76,29.77 73.48,30.48 VEML1.1 75.02,33.44 v75.28,33.44 | 60.87,37.38 60.87,39.14 58.61,41.39 58.61,46.92 61.04,49.34 61.97,49.34 62.93,50.31 63.6,50.31 63.62,50.33 71.44,50.33 v71.74,50.02 72.28,49.48 U2.2 | 60.87,37.38 U$3.19/A5 | R4.1 60.88,37.37 60.87,37.38
  Bottom 0.203: U$8.CTRL_CLK 72.64,54.03 72.07,53.46 72.07,50.35 v71.74,50.02 | v75.28,33.44 74.9,33.06 68.06,33.06 67.3,33.82 67.3,34.08 65.9,35.48 61.72,35.48 60.87,36.33 U$3.19/A5
SD_CS  (via drill 0.35)
  Top 0.203: U$3.10 69.96,52.59 68.92,51.54 63.07,51.54 63.05,51.52 62.43,51.52 61.47,50.56 60.54,50.56 57.39,47.42 57.39,41.7 57.27,41.57 57.27,32.66 57.67,32.26 v57.67,32.17 | v58.03,28.34 61.68,28.34 R11.1 | J7.2 57.36,15.4 57.8,15.84 57.8,18.66 v57.81,18.65
  Bottom 0.203: v57.67,32.17 57.95,31.89 57.95,29.12 58.03,29.05 v58.03,28.34 57.81,28.12 v57.81,18.65
SDA  (via drill 0.35)
  Top 0.203: VMEL1.2 70.35,29.77 69.67,30.45 VEML1.4 69.67,31.24 69.69,31.21 67.5,31.21 66.06,32.66 65.01,32.66 63.7,33.96 R3.1 63.47,37.2 63.32,37.34 | U2.3 72.69,47.9 72.53,47.9 71.75,48.69 v71.75,48.99 71.47,48.99 70.56,49.9 63.1,49.9 62.14,48.94 61.21,48.94 59.02,46.75 59.02,41.65 63.32,37.34 | 63.32,37.34 U$3.18/A4
  Bottom 0.203: U$8.CTRL_DATA 73.59,55.05 73.59,54.39 72.47,53.28 72.47,49.72 v71.75,48.99
SPI_CLK  (via drill 0.35, 0.51)
  Top 0.203: v65.02,33.82 65.02,34.38 66.75,36.11 72.33,36.11 U$3.14/A0 | v57.12,16.12 57.04,16.2 54.65,16.2 54.06,15.61 J7.5
  Bottom 0.203: v57.12,16.12 57.22,16.02 62.5,16.02 64.05,17.57 64.05,32.2 65.02,33.16 v65.02,33.82
TPA_SHDN  (via drill 0.35)
  Top 0.203: U$3.3 52.18,52.59 51.14,53.63 49.53,53.63 48.77,54.38 48.77,62.85 49.28,63.36 50.14,63.36 50.29,63.21 v50.31,63.21
  Bottom 0.203: AMP.3 50.48,62.24 50.33,62.39 50.33,63.19 v50.31,63.21
VEML_INT  (via drill 0.35)
  Top 0.203: v49.18,48.44 49.84,47.78 50.63,47.78 51.14,47.27 51.14,43.01 v50.11,41.98 | VMEL1.3 70.42,29.12 69.07,30.46 53.4,30.46 50.33,33.52 v50.33,33.57
  Bottom 0.203: U$3.2 50.71,49.96 v49.18,48.44 | 50.1,41.97 v50.11,41.98 50.11,38.22 49.66,37.78 49.66,36.91 50.33,36.24 v50.33,33.57
VIN
  Top 1.27: PWR_REG.VIN 15.84,44.51 C2.+
  Bottom 2.54: BT1.PWR@1 15.28,69.25 15.28,44.51 PWR_REG.VIN
VOL  (via drill 0.35)
  Top 0.305: U$6.P$1 40.28,56.58 43.08,53.78 48.64,53.78 49.38,53.04 49.38,52.36 50.25,51.49 53.7,51.49 54.34,52.13 54.34,52.97 55.41,54.04 v55.69,54.04
  Bottom 0.305: v55.69,54.04 55.68,54.05 AMP.14

### Text on the board
tPlace: Legatus | v0.1, 2020 | NVS | L | R | VOLUME | OFF | L | R | R | L | L | ON | R | RATE | R | L | ON | OFF | 1 | 2 | 3 | 4 | 5 | 6 | 7 | 8 | movee | movee | movee
bPlace: L | R | L | R | R | L | R | L | L | R
bValues: + | - | + | -